# Altium project VOU_SOM_CV_V0.0.1.PrjPcb (part 1 of 2)
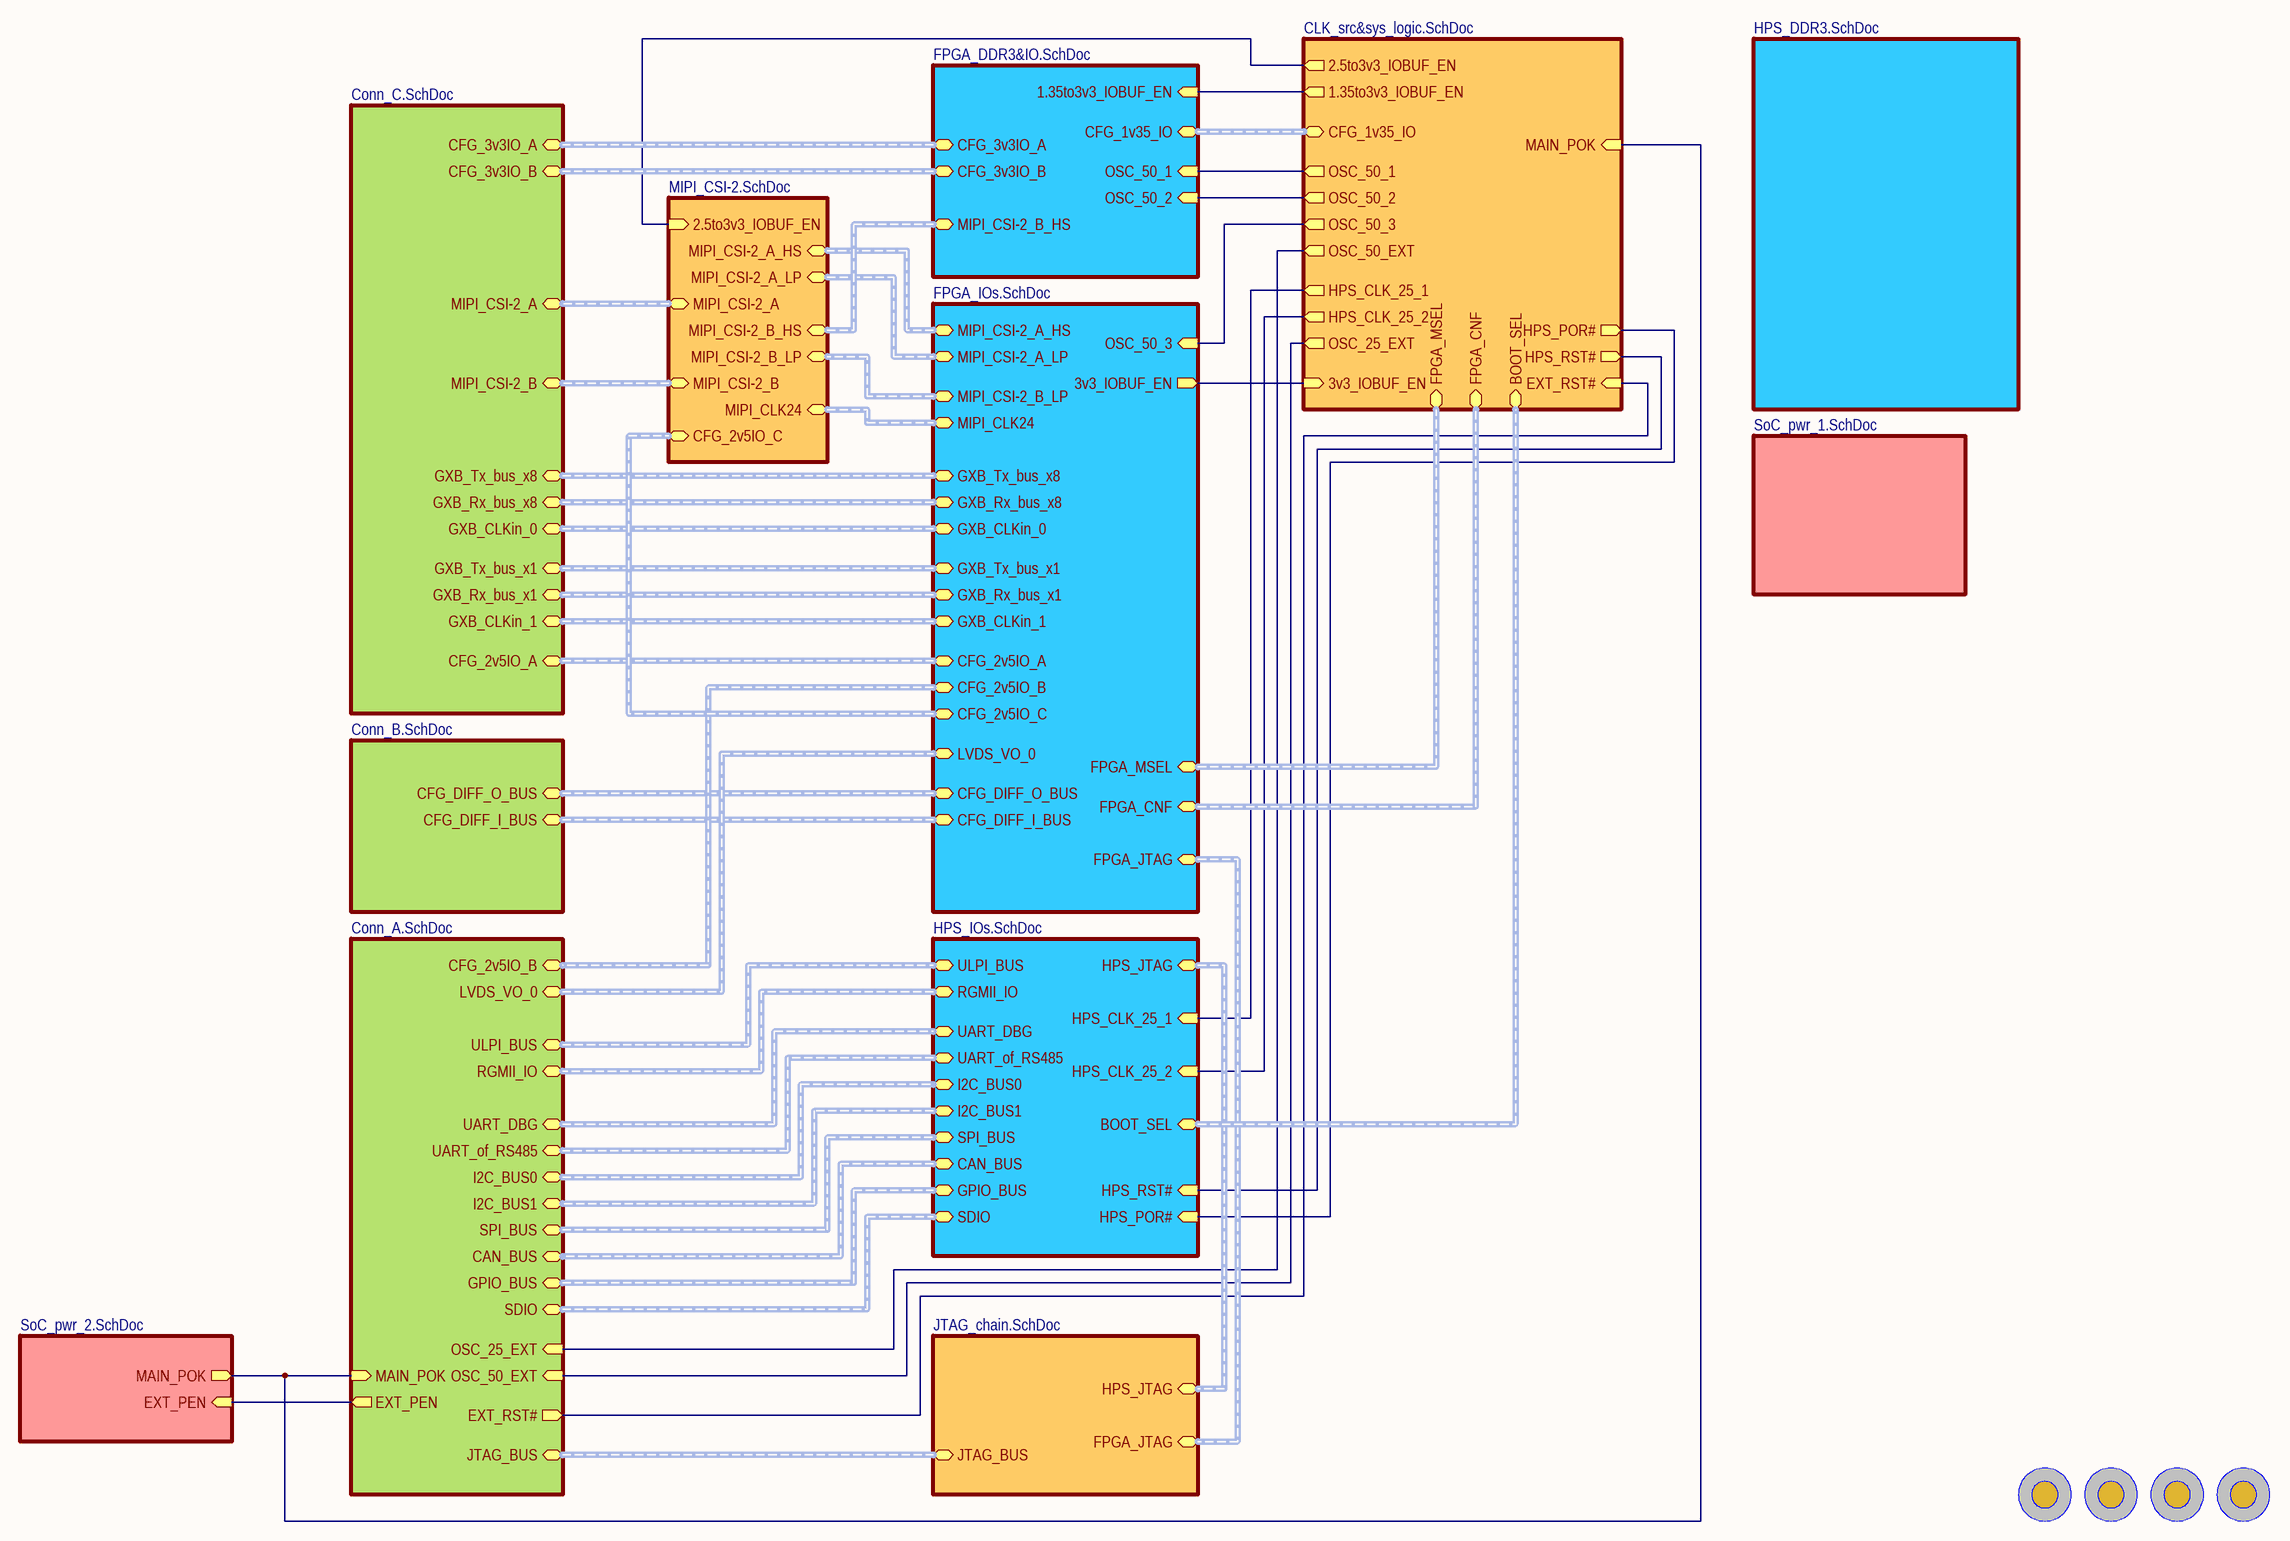
[diagram p0: VOU_SOM_CV_V0.0.1.SchDoc]
7 sheets, 106 parts. Net scope: hierarchical (ports join the sheet entries above them; power ports are global).
Board file: VOU_SOM_CV_V0.0.1.PcbDoc
Sheets:
  VOU_SOM_CV_V0.0.1.SchDoc
    Conn_A.SchDoc = Conn_A.SchDoc
    Conn_B.SchDoc = Conn_B.SchDoc
    Conn_C.SchDoc = Conn_C.SchDoc
    HPS_DDR3.SchDoc = HPS_DDR3.SchDoc
    HPS_IOs.SchDoc = HPS_IOs.SchDoc
    CLK_src&sys_logic.SchDoc = CLK_src&sys_logic.SchDoc

## Sheet VOU_SOM_CV_V0.0.1.SchDoc
size 593 x 419 mm; DocumentNumber: 1; SheetNumber: 1; SheetTotal: 12; Razrabotal: Савицкий

### Parts
RP_BL  Comment  [Reper-Normal]  (value not drawn)  (no BOM)
RP_BR  Comment  [Reper-Normal]  (value not drawn)  (no BOM)
RP_LT  Comment  [Reper-Normal]  (value not drawn)  (no BOM)
RP_RT  Comment  [Reper-Normal]  (value not drawn)  (no BOM)

### Sub-sheets
CLK_src&sys_logic.SchDoc = CLK_src&sys_logic.SchDoc: HPS_CLK_25_1 (out), HPS_CLK_25_2 (out), OSC_50_1 (out), OSC_50_2 (out), OSC_50_3 (out), OSC_50_EXT (out), OSC_25_EXT (out), MAIN_POK (in), EXT_RST# (in), 3v3_IOBUF_EN (in), 1.35to3v3_IOBUF_EN (out), 2.5to3v3_IOBUF_EN (out), HPS_RST# (out), HPS_POR# (out), FPGA_MSEL (harness FPGA_MSEL), FPGA_CNF (harness FPGA_CNF), BOOT_SEL (harness BOOT_SEL), CFG_1v35_IO (harness CFG_1v35_IO)
Conn_A.SchDoc = Conn_A.SchDoc: MAIN_POK (in), EXT_PEN (out), ULPI_BUS (harness ULPI_BUS), RGMII_IO (harness RGMII_IO), UART_DBG (harness UART_DBG), UART_of_RS485 (harness UART_of_RS485), I2C_BUS0 (harness I2C_BUS0), I2C_BUS1 (harness I2C_BUS1), SPI_BUS (harness SPI_BUS), CFG_2v5IO_B (harness CFG_2v5IO_B), JTAG_BUS (harness JTAG_BUS), LVDS_VO_0 (harness LVDS_VO_0), CAN_BUS (harness CAN_BUS), GPIO_BUS (harness GPIO_BUS), SDIO (harness SDIO), OSC_50_EXT (in), OSC_25_EXT (in), EXT_RST# (out)
Conn_B.SchDoc = Conn_B.SchDoc: CFG_DIFF_I_BUS (harness CFG_DIFF_I_BUS), CFG_DIFF_O_BUS (harness CFG_DIFF_O_BUS)
Conn_C.SchDoc = Conn_C.SchDoc: CFG_2v5IO_A (harness CFG_2v5IO_A), CFG_3v3IO_A (harness CFG_3v3IO_A), CFG_3v3IO_B (harness CFG_3v3IO_B), MIPI_CSI-2_A (harness MIPI_CSI-2_A), MIPI_CSI-2_B (harness MIPI_CSI-2_B), GXB_Tx_bus_x8 (harness GXB_Tx_bus_x8), GXB_Rx_bus_x1 (harness GXB_Rx_bus_x1), GXB_Rx_bus_x8 (harness GXB_Rx_bus_x8), GXB_Tx_bus_x1 (harness GXB_Tx_bus_x1), GXB_CLKin_0 (harness GXB_CLKin_0), GXB_CLKin_1 (harness GXB_CLKin_1)
DIMS_DSP_MainBoard_Interface.SchDoc = MIPI_CSI-2.SchDoc (file not in this document): MIPI_CSI-2_B_HS (harness MIPI_CSI-2_B_HS), MIPI_CSI-2_B_LP (harness MIPI_CSI-2_B_LP), MIPI_CSI-2_A_HS (harness MIPI_CSI-2_A_HS), MIPI_CSI-2_A_LP (harness MIPI_CSI-2_A_LP), MIPI_CSI-2_A (harness MIPI_CSI-2_A), MIPI_CSI-2_B (harness MIPI_CSI-2_B), MIPI_CLK24 (harness MIPI_CLK24), 2.5to3v3_IOBUF_EN (in), CFG_2v5IO_C (harness CFG_2v5IO_C)
FPGA_DDR3&IO.SchDoc = FPGA_DDR3&IO.SchDoc (file not in this document): MIPI_CSI-2_B_HS (harness MIPI_CSI-2_B_HS), CFG_3v3IO_A (harness CFG_3v3IO_A), CFG_3v3IO_B (harness CFG_3v3IO_B), OSC_50_1 (in), OSC_50_2 (in), 1.35to3v3_IOBUF_EN (in), CFG_1v35_IO (harness CFG_1v35_IO)
FPGA_IOs.SchDoc = FPGA_IOs.SchDoc (file not in this document): MIPI_CSI-2_B_LP (harness MIPI_CSI-2_B_LP), MIPI_CSI-2_A_LP (harness MIPI_CSI-2_A_LP), MIPI_CSI-2_A_HS (harness MIPI_CSI-2_A_HS), CFG_2v5IO_A (harness CFG_2v5IO_A), CFG_2v5IO_B (harness CFG_2v5IO_B), GXB_Rx_bus_x1 (harness GXB_Rx_bus_x1), GXB_Tx_bus_x1 (harness GXB_Tx_bus_x1), GXB_CLKin_1 (harness GXB_CLKin_1), GXB_Tx_bus_x8 (harness GXB_Tx_bus_x8), GXB_Rx_bus_x8 (harness GXB_Rx_bus_x8), GXB_CLKin_0 (harness GXB_CLKin_0), CFG_DIFF_I_BUS (harness CFG_DIFF_I_BUS), CFG_DIFF_O_BUS (harness CFG_DIFF_O_BUS), FPGA_JTAG (harness FPGA_JTAG), LVDS_VO_0 (harness LVDS_VO_0), FPGA_MSEL (harness FPGA_MSEL), OSC_50_3 (in), MIPI_CLK24 (harness MIPI_CLK24), 3v3_IOBUF_EN (out), FPGA_CNF (harness FPGA_CNF), CFG_2v5IO_C (harness CFG_2v5IO_C)
HPS_DDR3.SchDoc = HPS_DDR3.SchDoc: no entries
HPS_IOs.SchDoc = HPS_IOs.SchDoc: ULPI_BUS (harness ULPI_BUS), RGMII_IO (harness RGMII_IO), UART_DBG (harness UART_DBG), UART_of_RS485 (harness UART_of_RS485), I2C_BUS0 (harness I2C_BUS0), I2C_BUS1 (harness I2C_BUS1), SPI_BUS (harness SPI_BUS), CAN_BUS (harness CAN_BUS), GPIO_BUS (harness GPIO_BUS), HPS_JTAG (harness HPS_JTAG), SDIO (harness SDIO), HPS_CLK_25_1 (in), HPS_CLK_25_2 (in), HPS_RST# (in), HPS_POR# (in), BOOT_SEL (harness BOOT_SEL)
JTAG_chain.SchDoc = JTAG_chain.SchDoc (file not in this document): JTAG_BUS (harness JTAG_BUS), HPS_JTAG (harness HPS_JTAG), FPGA_JTAG (harness FPGA_JTAG)
SoC_pwr_1.SchDoc = SoC_pwr_1.SchDoc (file not in this document): no entries
SoC_pwr_2.SchDoc = SoC_pwr_2.SchDoc (file not in this document): MAIN_POK (out), EXT_PEN (in)

### Nets
1.35to3v3_IOBUF_EN: sheet FPGA_DDR3&IO.SchDoc/1.35to3v3_IOBUF_EN, sheet CLK_src&sys_logic.SchDoc/1.35to3v3_IOBUF_EN
2.5to3v3_IOBUF_EN: sheet DIMS_DSP_MainBoard_Interface.SchDoc/2.5to3v3_IOBUF_EN, sheet CLK_src&sys_logic.SchDoc/2.5to3v3_IOBUF_EN
3v3_IOBUF_EN: sheet FPGA_IOs.SchDoc/3v3_IOBUF_EN, sheet CLK_src&sys_logic.SchDoc/3v3_IOBUF_EN
EXT_PEN: sheet Conn_A.SchDoc/EXT_PEN, sheet SoC_pwr_2.SchDoc/EXT_PEN
EXT_RST#: sheet Conn_A.SchDoc/EXT_RST#, sheet CLK_src&sys_logic.SchDoc/EXT_RST#
HPS_CLK_25_1: sheet HPS_IOs.SchDoc/HPS_CLK_25_1, sheet CLK_src&sys_logic.SchDoc/HPS_CLK_25_1
HPS_CLK_25_2: sheet HPS_IOs.SchDoc/HPS_CLK_25_2, sheet CLK_src&sys_logic.SchDoc/HPS_CLK_25_2
MAIN_POK: sheet Conn_A.SchDoc/MAIN_POK, sheet CLK_src&sys_logic.SchDoc/MAIN_POK, sheet SoC_pwr_2.SchDoc/MAIN_POK
NetD2_C27: sheet HPS_IOs.SchDoc/HPS_RST#, sheet CLK_src&sys_logic.SchDoc/HPS_RST#
NetD2_F23: sheet HPS_IOs.SchDoc/HPS_POR#, sheet CLK_src&sys_logic.SchDoc/HPS_POR#
NetR4_2: sheet FPGA_DDR3&IO.SchDoc/OSC_50_1, sheet CLK_src&sys_logic.SchDoc/OSC_50_1
NetR5_2: sheet FPGA_DDR3&IO.SchDoc/OSC_50_2, sheet CLK_src&sys_logic.SchDoc/OSC_50_2
NetR6_2: sheet FPGA_IOs.SchDoc/OSC_50_3, sheet CLK_src&sys_logic.SchDoc/OSC_50_3
NetR7_2: sheet Conn_A.SchDoc/OSC_25_EXT, sheet CLK_src&sys_logic.SchDoc/OSC_50_EXT
NetR11_2: sheet Conn_A.SchDoc/OSC_50_EXT, sheet CLK_src&sys_logic.SchDoc/OSC_25_EXT

### Buses and harness runs
harness sheet CLK_src&sys_logic.SchDoc/BOOT_SEL = sheet HPS_IOs.SchDoc/BOOT_SEL
harness sheet CLK_src&sys_logic.SchDoc/CFG_1v35_IO = sheet FPGA_DDR3&IO.SchDoc/CFG_1v35_IO
harness sheet CLK_src&sys_logic.SchDoc/FPGA_CNF = sheet FPGA_IOs.SchDoc/FPGA_CNF
harness sheet CLK_src&sys_logic.SchDoc/FPGA_MSEL = sheet FPGA_IOs.SchDoc/FPGA_MSEL
harness sheet Conn_A.SchDoc/CAN_BUS = sheet HPS_IOs.SchDoc/CAN_BUS
harness sheet Conn_A.SchDoc/CFG_2v5IO_B = sheet FPGA_IOs.SchDoc/CFG_2v5IO_B
harness sheet Conn_A.SchDoc/GPIO_BUS = sheet HPS_IOs.SchDoc/GPIO_BUS
harness sheet Conn_A.SchDoc/I2C_BUS0 = sheet HPS_IOs.SchDoc/I2C_BUS0
harness sheet Conn_A.SchDoc/I2C_BUS1 = sheet HPS_IOs.SchDoc/I2C_BUS1
harness sheet Conn_A.SchDoc/JTAG_BUS = sheet JTAG_chain.SchDoc/JTAG_BUS
harness sheet Conn_A.SchDoc/LVDS_VO_0 = sheet FPGA_IOs.SchDoc/LVDS_VO_0
harness sheet Conn_A.SchDoc/RGMII_IO = sheet HPS_IOs.SchDoc/RGMII_IO
harness sheet Conn_A.SchDoc/SDIO = sheet HPS_IOs.SchDoc/SDIO
harness sheet Conn_A.SchDoc/SPI_BUS = sheet HPS_IOs.SchDoc/SPI_BUS
harness sheet Conn_A.SchDoc/UART_DBG = sheet HPS_IOs.SchDoc/UART_DBG
harness sheet Conn_A.SchDoc/UART_of_RS485 = sheet HPS_IOs.SchDoc/UART_of_RS485
harness sheet Conn_A.SchDoc/ULPI_BUS = sheet HPS_IOs.SchDoc/ULPI_BUS
harness sheet Conn_B.SchDoc/CFG_DIFF_I_BUS = sheet FPGA_IOs.SchDoc/CFG_DIFF_I_BUS
harness sheet Conn_B.SchDoc/CFG_DIFF_O_BUS = sheet FPGA_IOs.SchDoc/CFG_DIFF_O_BUS
harness sheet Conn_C.SchDoc/CFG_2v5IO_A = sheet FPGA_IOs.SchDoc/CFG_2v5IO_A
harness sheet Conn_C.SchDoc/CFG_3v3IO_A = sheet FPGA_DDR3&IO.SchDoc/CFG_3v3IO_A
harness sheet Conn_C.SchDoc/CFG_3v3IO_B = sheet FPGA_DDR3&IO.SchDoc/CFG_3v3IO_B
harness sheet Conn_C.SchDoc/GXB_CLKin_0 = sheet FPGA_IOs.SchDoc/GXB_CLKin_0
harness sheet Conn_C.SchDoc/GXB_CLKin_1 = sheet FPGA_IOs.SchDoc/GXB_CLKin_1
harness sheet Conn_C.SchDoc/GXB_Rx_bus_x1 = sheet FPGA_IOs.SchDoc/GXB_Rx_bus_x1
harness sheet Conn_C.SchDoc/GXB_Rx_bus_x8 = sheet FPGA_IOs.SchDoc/GXB_Rx_bus_x8
harness sheet Conn_C.SchDoc/GXB_Tx_bus_x1 = sheet FPGA_IOs.SchDoc/GXB_Tx_bus_x1
harness sheet Conn_C.SchDoc/GXB_Tx_bus_x8 = sheet FPGA_IOs.SchDoc/GXB_Tx_bus_x8
harness sheet Conn_C.SchDoc/MIPI_CSI-2_A = sheet DIMS_DSP_MainBoard_Interface.SchDoc/MIPI_CSI-2_A
harness sheet Conn_C.SchDoc/MIPI_CSI-2_B = sheet DIMS_DSP_MainBoard_Interface.SchDoc/MIPI_CSI-2_B
harness sheet DIMS_DSP_MainBoard_Interface.SchDoc/CFG_2v5IO_C = sheet FPGA_IOs.SchDoc/CFG_2v5IO_C
harness sheet DIMS_DSP_MainBoard_Interface.SchDoc/MIPI_CLK24 = sheet FPGA_IOs.SchDoc/MIPI_CLK24
harness sheet DIMS_DSP_MainBoard_Interface.SchDoc/MIPI_CSI-2_A_HS = sheet FPGA_IOs.SchDoc/MIPI_CSI-2_A_HS
harness sheet DIMS_DSP_MainBoard_Interface.SchDoc/MIPI_CSI-2_A_LP = sheet FPGA_IOs.SchDoc/MIPI_CSI-2_A_LP
harness sheet DIMS_DSP_MainBoard_Interface.SchDoc/MIPI_CSI-2_B_HS = sheet FPGA_DDR3&IO.SchDoc/MIPI_CSI-2_B_HS
harness sheet DIMS_DSP_MainBoard_Interface.SchDoc/MIPI_CSI-2_B_LP = sheet FPGA_IOs.SchDoc/MIPI_CSI-2_B_LP
harness sheet FPGA_IOs.SchDoc/FPGA_JTAG = sheet JTAG_chain.SchDoc/FPGA_JTAG
harness sheet HPS_IOs.SchDoc/HPS_JTAG = sheet JTAG_chain.SchDoc/HPS_JTAG

### Notes on the sheet
- Перв. примен.
- Справ. №
- Подп. и дата
- Инв. № дубл.
- Взам. инв. №
- Изм.
- Лист
- № докум.
- Подп.
- Дата
- Лит.
- Масса
- Масштаб
- Разраб.
- Пров.
- Т.контр.
- Схема электрическая принципиальная
- Листов
- Инв. № подл.
- Н.контр.
- Утв.
- Копировал:
- Формат А2

### Library data of the parts
RP_BL RP_BR RP_LT RP_RT = Reper: Стабилизатор положительного напряжения

## Sheet Conn_A.SchDoc
size A1
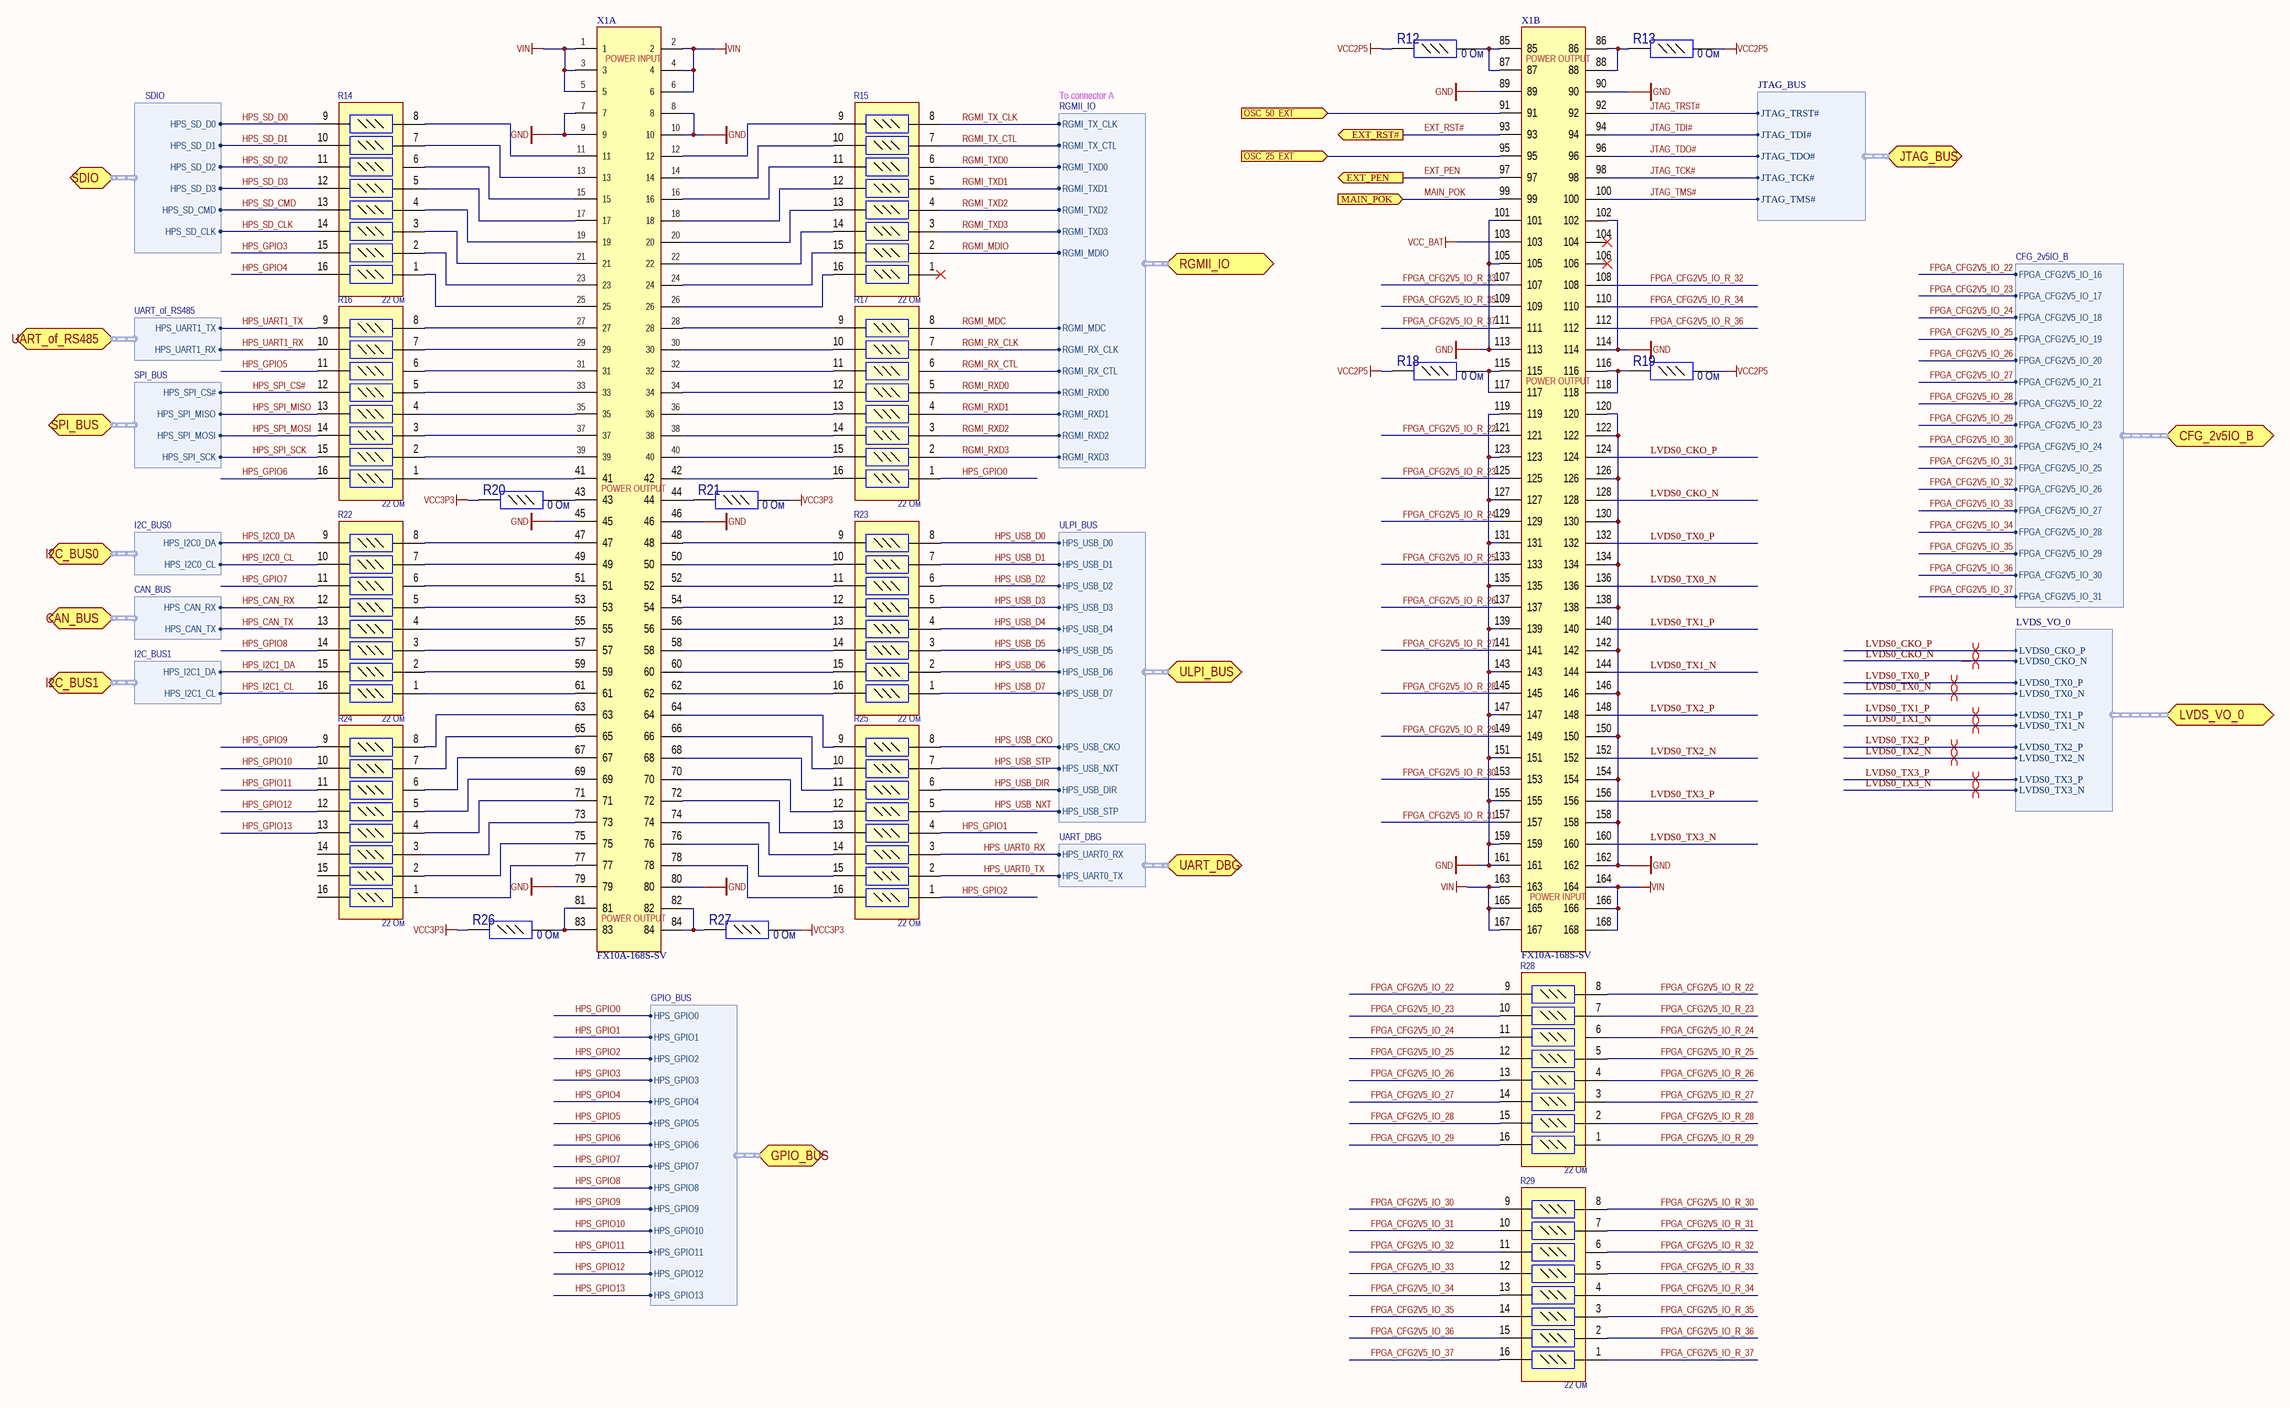
[diagram p1: Conn_A.SchDoc]

### Parts
R12  value 0 Ом  [CR0603]  (hidden comment: CR0603-0 Ом-±5%)
R13  value 0 Ом  [CR0603]  (hidden comment: CR0603-0 Ом-±5%)
R14  value 22 Ом  [CAT16-J8]  (hidden comment: YC248-JR-07-22 Ом)
R15  value 22 Ом  [CAT16-J8]  (hidden comment: YC248-JR-07-22 Ом)
R16  value 22 Ом  [CAT16-J8]  (hidden comment: YC248-JR-07-22 Ом)
R17  value 22 Ом  [CAT16-J8]  (hidden comment: YC248-JR-07-22 Ом)
R18  value 0 Ом  [CR0603]  (hidden comment: CR0603-0 Ом-±5%)
R19  value 0 Ом  [CR0603]  (hidden comment: CR0603-0 Ом-±5%)
R20  value 0 Ом  [CR0603]  (hidden comment: CR0603-0 Ом-±5%)
R21  value 0 Ом  [CR0603]  (hidden comment: CR0603-0 Ом-±5%)
R22  value 22 Ом  [CAT16-J8]  (hidden comment: YC248-JR-07-22 Ом)
R23  value 22 Ом  [CAT16-J8]  (hidden comment: YC248-JR-07-22 Ом)
R24  value 22 Ом  [CAT16-J8]  (hidden comment: YC248-JR-07-22 Ом)
R25  value 22 Ом  [CAT16-J8]  (hidden comment: YC248-JR-07-22 Ом)
R26  value 0 Ом  [CR0603]  (hidden comment: CR0603-0 Ом-±5%)
R27  value 0 Ом  [CR0603]  (hidden comment: CR0603-0 Ом-±5%)
R28  value 22 Ом  [CAT16-J8]  (hidden comment: YC248-JR-07-22 Ом)
R29  value 22 Ом  [CAT16-J8]  (hidden comment: YC248-JR-07-22 Ом)
X1  FX10A-168S-SV  [FX10A-168S-SV]  (parts A,B of 2)

### Ports
CAN_BUS (harness CAN_BUS), CFG_2v5IO_B (harness CFG_2v5IO_B), EXT_PEN (out), EXT_RST# (out), GPIO_BUS (harness GPIO_BUS), I2C_BUS0 (harness I2C_BUS0), I2C_BUS1 (harness I2C_BUS1), JTAG_BUS (harness JTAG_BUS), LVDS_VO_0 (harness LVDS_VO_0), MAIN_POK (in), OSC_25_EXT (in), OSC_50_EXT (in), RGMII_IO (harness RGMII_IO), SDIO (harness SDIO), SPI_BUS (harness SPI_BUS), UART_DBG (harness UART_DBG), UART_of_RS485 (harness UART_of_RS485), ULPI_BUS (harness ULPI_BUS)

### Harnesses
LVDS_VO_0: LVDS0_CKO_P, LVDS0_CKO_N, LVDS0_TX0_P, LVDS0_TX0_N, LVDS0_TX1_P, LVDS0_TX1_N, LVDS0_TX2_P, LVDS0_TX2_N, LVDS0_TX3_P, LVDS0_TX3_N
JTAG_BUS: JTAG_TRST#, JTAG_TDI#, JTAG_TDO#, JTAG_TCK#, JTAG_TMS#
SDIO: HPS_SD_D0, HPS_SD_D1, HPS_SD_D2, HPS_SD_D3, HPS_SD_CMD, HPS_SD_CLK
ULPI_BUS: HPS_USB_D0, HPS_USB_D1, HPS_USB_D2, HPS_USB_D3, HPS_USB_D4, HPS_USB_D5, HPS_USB_D6, HPS_USB_D7, HPS_USB_CKO, HPS_USB_NXT, HPS_USB_DIR, HPS_USB_STP
UART_DBG: HPS_UART0_RX, HPS_UART0_TX
UART_of_RS485: HPS_UART1_RX, HPS_UART1_TX
GPIO_BUS: HPS_GPIO0, HPS_GPIO1, HPS_GPIO2, HPS_GPIO3, HPS_GPIO4, HPS_GPIO5, HPS_GPIO6, HPS_GPIO7, HPS_GPIO8, HPS_GPIO9, HPS_GPIO10, HPS_GPIO11, HPS_GPIO12, HPS_GPIO13
SPI_BUS: HPS_SPI_MOSI, HPS_SPI_MISO, HPS_SPI_SCK, HPS_SPI_CS#
I2C_BUS0: HPS_I2C0_DA, HPS_I2C0_CL
I2C_BUS1: HPS_I2C1_DA, HPS_I2C1_CL
CAN_BUS: HPS_CAN_TX, HPS_CAN_RX
RGMII_IO: RGMI_TX_CLK, RGMI_TXD0, RGMI_TXD1, RGMI_TXD2, RGMI_TXD3, RGMI_RXD0, RGMI_RXD1, RGMI_RXD2, RGMI_RXD3, RGMI_TX_CTL, RGMI_RX_CTL, RGMI_RX_CLK, RGMI_MDIO, RGMI_MDC
CFG_2v5IO_B: FPGA_CFG2V5_IO_16, FPGA_CFG2V5_IO_17, FPGA_CFG2V5_IO_18, FPGA_CFG2V5_IO_19, FPGA_CFG2V5_IO_20, FPGA_CFG2V5_IO_21, FPGA_CFG2V5_IO_22, FPGA_CFG2V5_IO_23, FPGA_CFG2V5_IO_24, FPGA_CFG2V5_IO_25, FPGA_CFG2V5_IO_26, FPGA_CFG2V5_IO_27, FPGA_CFG2V5_IO_28, FPGA_CFG2V5_IO_29, FPGA_CFG2V5_IO_30, FPGA_CFG2V5_IO_31

### Nets
GND: X1.7 X1.8 X1.9 X1.10 X1.45 X1.46 X1.79 X1.80 X1.89 X1.90 X1.101 X1.102 X1.105 X1.113 X1.114 X1.119 X1.120 X1.122 X1.123 X1.126 X1.127 X1.130 X1.131 X1.134 X1.135 X1.138 X1.139 X1.142 X1.143 X1.146 X1.147 X1.150 X1.151 X1.154 X1.155 X1.158 X1.159 X1.161 X1.162
VCC2P5: R12.1(+) R13.2(-) R18.1(+) R19.2(-)
VCC3P3: R20.1(+) R21.2(-) R26.1(+) R27.2(-)
VCC_BAT: X1.103
VIN: X1.1 X1.2 X1.3 X1.4 X1.5 X1.6 X1.163 X1.164 X1.165 X1.166 X1.167 X1.168
EXT_PEN: X1.97 ; port EXT_PEN
EXT_RST#: X1.93 ; port EXT_RST#
FPGA_CFG2V5_IO_22: R28.9 ; port CFG_2v5IO_B.FPGA_CFG2V5_IO_16
FPGA_CFG2V5_IO_23: R28.10 ; port CFG_2v5IO_B.FPGA_CFG2V5_IO_17
FPGA_CFG2V5_IO_24: R28.11 ; port CFG_2v5IO_B.FPGA_CFG2V5_IO_18
FPGA_CFG2V5_IO_25: R28.12 ; port CFG_2v5IO_B.FPGA_CFG2V5_IO_19
FPGA_CFG2V5_IO_26: R28.13 ; port CFG_2v5IO_B.FPGA_CFG2V5_IO_20
FPGA_CFG2V5_IO_27: R28.14 ; port CFG_2v5IO_B.FPGA_CFG2V5_IO_21
FPGA_CFG2V5_IO_28: R28.15 ; port CFG_2v5IO_B.FPGA_CFG2V5_IO_22
FPGA_CFG2V5_IO_29: R28.16 ; port CFG_2v5IO_B.FPGA_CFG2V5_IO_23
FPGA_CFG2V5_IO_30: R29.9 ; port CFG_2v5IO_B.FPGA_CFG2V5_IO_24
FPGA_CFG2V5_IO_31: R29.10 ; port CFG_2v5IO_B.FPGA_CFG2V5_IO_25
FPGA_CFG2V5_IO_32: R29.11 ; port CFG_2v5IO_B.FPGA_CFG2V5_IO_26
FPGA_CFG2V5_IO_33: R29.12 ; port CFG_2v5IO_B.FPGA_CFG2V5_IO_27
FPGA_CFG2V5_IO_34: R29.13 ; port CFG_2v5IO_B.FPGA_CFG2V5_IO_28
FPGA_CFG2V5_IO_35: R29.14 ; port CFG_2v5IO_B.FPGA_CFG2V5_IO_29
FPGA_CFG2V5_IO_36: R29.15 ; port CFG_2v5IO_B.FPGA_CFG2V5_IO_30
FPGA_CFG2V5_IO_37: R29.16 ; port CFG_2v5IO_B.FPGA_CFG2V5_IO_31
FPGA_CFG2V5_IO_R_22: R28.8 X1.121
FPGA_CFG2V5_IO_R_23: R28.7 X1.125
FPGA_CFG2V5_IO_R_24: R28.6 X1.129
FPGA_CFG2V5_IO_R_25: R28.5 X1.133
FPGA_CFG2V5_IO_R_26: R28.4 X1.137
FPGA_CFG2V5_IO_R_27: R28.3 X1.141
FPGA_CFG2V5_IO_R_28: R28.2 X1.145
FPGA_CFG2V5_IO_R_29: R28.1 X1.149
FPGA_CFG2V5_IO_R_30: R29.8 X1.153
FPGA_CFG2V5_IO_R_31: R29.7 X1.157
FPGA_CFG2V5_IO_R_32: R29.6 X1.108
FPGA_CFG2V5_IO_R_33: R29.5 X1.107
FPGA_CFG2V5_IO_R_34: R29.4 X1.110
FPGA_CFG2V5_IO_R_35: R29.3 X1.109
FPGA_CFG2V5_IO_R_36: R29.2 X1.112
FPGA_CFG2V5_IO_R_37: R29.1 X1.111
HPS_CAN_RX: R22.12 ; port CAN_BUS.HPS_CAN_RX
HPS_CAN_TX: R22.13 ; port CAN_BUS.HPS_CAN_TX
HPS_GPIO0: R17.1 ; port GPIO_BUS.HPS_GPIO0
HPS_GPIO1: R25.4 ; port GPIO_BUS.HPS_GPIO1
HPS_GPIO2: R25.1 ; port GPIO_BUS.HPS_GPIO2
HPS_GPIO3: R14.15 ; port GPIO_BUS.HPS_GPIO3
HPS_GPIO4: R14.16 ; port GPIO_BUS.HPS_GPIO4
HPS_GPIO5: R16.11 ; port GPIO_BUS.HPS_GPIO5
HPS_GPIO6: R16.16 ; port GPIO_BUS.HPS_GPIO6
HPS_GPIO7: R22.11 ; port GPIO_BUS.HPS_GPIO7
HPS_GPIO8: R22.14 ; port GPIO_BUS.HPS_GPIO8
HPS_GPIO9: R24.9 ; port GPIO_BUS.HPS_GPIO9
HPS_GPIO10: R24.10 ; port GPIO_BUS.HPS_GPIO10
HPS_GPIO11: R24.11 ; port GPIO_BUS.HPS_GPIO11
HPS_GPIO12: R24.12 ; port GPIO_BUS.HPS_GPIO12
HPS_GPIO13: R24.13 ; port GPIO_BUS.HPS_GPIO13
HPS_I2C0_CL: R22.10 ; port I2C_BUS0.HPS_I2C0_CL
HPS_I2C0_DA: R22.9 ; port I2C_BUS0.HPS_I2C0_DA
HPS_I2C1_CL: R22.16 ; port I2C_BUS1.HPS_I2C1_CL
HPS_I2C1_DA: R22.15 ; port I2C_BUS1.HPS_I2C1_DA
HPS_SD_CLK: R14.14 ; port SDIO.HPS_SD_CLK
HPS_SD_CMD: R14.13 ; port SDIO.HPS_SD_CMD
HPS_SD_D0: R14.9 ; port SDIO.HPS_SD_D0
HPS_SD_D1: R14.10 ; port SDIO.HPS_SD_D1
HPS_SD_D2: R14.11 ; port SDIO.HPS_SD_D2
HPS_SD_D3: R14.12 ; port SDIO.HPS_SD_D3
HPS_SPI_CS#: R16.12 ; port SPI_BUS.HPS_SPI_CS#  [project net HPS_BSL0]
HPS_SPI_MISO: R16.13 ; port SPI_BUS.HPS_SPI_MISO
HPS_SPI_MOSI: R16.14 ; port SPI_BUS.HPS_SPI_MOSI
HPS_SPI_SCK: R16.15 ; port SPI_BUS.HPS_SPI_SCK
HPS_UART0_RX: R25.3 ; port UART_DBG.HPS_UART0_RX
HPS_UART0_TX: R25.2 ; port UART_DBG.HPS_UART0_TX
HPS_UART1_RX: R16.10 ; port UART_of_RS485.HPS_UART1_RX
HPS_UART1_TX: R16.9 ; port UART_of_RS485.HPS_UART1_TX
HPS_USB_CKO: R25.8 ; port ULPI_BUS.HPS_USB_CKO
HPS_USB_D0: R23.8 ; port ULPI_BUS.HPS_USB_D0
HPS_USB_D1: R23.7 ; port ULPI_BUS.HPS_USB_D1
HPS_USB_D2: R23.6 ; port ULPI_BUS.HPS_USB_D2
HPS_USB_D3: R23.5 ; port ULPI_BUS.HPS_USB_D3
HPS_USB_D4: R23.4 ; port ULPI_BUS.HPS_USB_D4
HPS_USB_D5: R23.3 ; port ULPI_BUS.HPS_USB_D5
HPS_USB_D6: R23.2 ; port ULPI_BUS.HPS_USB_D6
HPS_USB_D7: R23.1 ; port ULPI_BUS.HPS_USB_D7
HPS_USB_DIR: R25.6 ; port ULPI_BUS.HPS_USB_DIR
HPS_USB_NXT: R25.5 ; port ULPI_BUS.HPS_USB_STP
HPS_USB_STP: R25.7 ; port ULPI_BUS.HPS_USB_NXT
JTAG_TCK#: X1.98 ; port JTAG_BUS.JTAG_TCK#
JTAG_TDI#: X1.94 ; port JTAG_BUS.JTAG_TDI#
JTAG_TDO#: X1.96 ; port JTAG_BUS.JTAG_TDO#
JTAG_TMS#: X1.100 ; port JTAG_BUS.JTAG_TMS#
JTAG_TRST#: X1.92 ; port JTAG_BUS.JTAG_TRST#
LVDS0_CKO_N: X1.128 ; port LVDS_VO_0.LVDS0_CKO_N
LVDS0_CKO_P: X1.124 ; port LVDS_VO_0.LVDS0_CKO_P
LVDS0_TX0_N: X1.136 ; port LVDS_VO_0.LVDS0_TX0_N
LVDS0_TX0_P: X1.132 ; port LVDS_VO_0.LVDS0_TX0_P
LVDS0_TX1_N: X1.144 ; port LVDS_VO_0.LVDS0_TX1_N
LVDS0_TX1_P: X1.140 ; port LVDS_VO_0.LVDS0_TX1_P
LVDS0_TX2_N: X1.152 ; port LVDS_VO_0.LVDS0_TX2_N
LVDS0_TX2_P: X1.148 ; port LVDS_VO_0.LVDS0_TX2_P
LVDS0_TX3_N: X1.160 ; port LVDS_VO_0.LVDS0_TX3_N
LVDS0_TX3_P: X1.156 ; port LVDS_VO_0.LVDS0_TX3_P
MAIN_POK: X1.99 ; port MAIN_POK
RGMI_MDC: R17.8 ; port RGMII_IO.RGMI_MDC
RGMI_MDIO: R15.2 ; port RGMII_IO.RGMI_MDIO
RGMI_RX_CLK: R17.7 ; port RGMII_IO.RGMI_RX_CLK
RGMI_RX_CTL: R17.6 ; port RGMII_IO.RGMI_RX_CTL
RGMI_RXD0: R17.5 ; port RGMII_IO.RGMI_RXD0
RGMI_RXD1: R17.4 ; port RGMII_IO.RGMI_RXD1
RGMI_RXD2: R17.3 ; port RGMII_IO.RGMI_RXD2
RGMI_RXD3: R17.2 ; port RGMII_IO.RGMI_RXD3
RGMI_TX_CLK: R15.8 ; port RGMII_IO.RGMI_TX_CLK
RGMI_TX_CTL: R15.7 ; port RGMII_IO.RGMI_TX_CTL
RGMI_TXD0: R15.6 ; port RGMII_IO.RGMI_TXD0
RGMI_TXD1: R15.5 ; port RGMII_IO.RGMI_TXD1
RGMI_TXD2: R15.4 ; port RGMII_IO.RGMI_TXD2
RGMI_TXD3: R15.3 ; port RGMII_IO.RGMI_TXD3
NetR7_2: X1.95 ; port OSC_25_EXT
NetR11_2: X1.91 ; port OSC_50_EXT
NetR12_2: R12.2(-) X1.85 X1.87
NetR13_1: R13.1(+) X1.86 X1.88
NetR14_1: R14.1 X1.25
NetR14_2: R14.2 X1.23
NetR14_3: R14.3 X1.21
NetR14_4: R14.4 X1.19
NetR14_5: R14.5 X1.17
NetR14_6: R14.6 X1.15
NetR14_7: R14.7 X1.13
NetR14_8: R14.8 X1.11
NetR15_9: R15.9 X1.12
NetR15_10: R15.10 X1.14
NetR15_11: R15.11 X1.16
NetR15_12: R15.12 X1.18
NetR15_13: R15.13 X1.20
NetR15_14: R15.14 X1.22
NetR15_15: R15.15 X1.24
NetR15_16: R15.16 X1.26
NetR16_1: R16.1 X1.41
NetR16_2: R16.2 X1.39
NetR16_3: R16.3 X1.37
NetR16_4: R16.4 X1.35
NetR16_5: R16.5 X1.33
NetR16_6: R16.6 X1.31
NetR16_7: R16.7 X1.29
NetR16_8: R16.8 X1.27
NetR17_9: R17.9 X1.28
NetR17_10: R17.10 X1.30
NetR17_11: R17.11 X1.32
NetR17_12: R17.12 X1.34
NetR17_13: R17.13 X1.36
NetR17_14: R17.14 X1.38
NetR17_15: R17.15 X1.40
NetR17_16: R17.16 X1.42
NetR18_2: R18.2(-) X1.115 X1.117
NetR19_1: R19.1(+) X1.116 X1.118
NetR20_2: R20.2(-) X1.43
NetR21_1: R21.1(+) X1.44
NetR22_1: R22.1 X1.61
NetR22_2: R22.2 X1.59
NetR22_3: R22.3 X1.57
NetR22_4: R22.4 X1.55
NetR22_5: R22.5 X1.53
NetR22_6: R22.6 X1.51
NetR22_7: R22.7 X1.49
NetR22_8: R22.8 X1.47
NetR23_9: R23.9 X1.48
NetR23_10: R23.10 X1.50
NetR23_11: R23.11 X1.52
NetR23_12: R23.12 X1.54
NetR23_13: R23.13 X1.56
NetR23_14: R23.14 X1.58
NetR23_15: R23.15 X1.60
NetR23_16: R23.16 X1.62
NetR24_1: R24.1 X1.77
NetR24_2: R24.2 X1.75
NetR24_3: R24.3 X1.73
NetR24_4: R24.4 X1.71
NetR24_5: R24.5 X1.69
NetR24_6: R24.6 X1.67
NetR24_7: R24.7 X1.65
NetR24_8: R24.8 X1.63
NetR25_9: R25.9 X1.64
NetR25_10: R25.10 X1.66
NetR25_11: R25.11 X1.68
NetR25_12: R25.12 X1.70
NetR25_13: R25.13 X1.72
NetR25_14: R25.14 X1.74
NetR25_15: R25.15 X1.76
NetR25_16: R25.16 X1.78
NetR26_2: R26.2(-) X1.81 X1.83
NetR27_1: R27.1(+) X1.82 X1.84

Not connected (* = marked no-connect by the designer): R15 1*; R24 14 15 16; X1 104* 106*

### Layout directives
differential pair: LVDS0_CKO_N, LVDS0_CKO_P, LVDS0_TX0_N, LVDS0_TX0_P, LVDS0_TX1_N, LVDS0_TX1_P, LVDS0_TX2_N, LVDS0_TX2_P, LVDS0_TX3_N, LVDS0_TX3_P

### Notes on the sheet
- (near X1) POWER INPUT
- To connector A
- (near X1) POWER OUTPUT

### Library data of the parts
R12 R13 R18-R21 R26 R27 = CR0603-#-±5%: Чип резистор
R14-R17 R22-R25 R28 R29 = YC248-JR-07-#: Набор чип резисторов; P: 0.062 Вт; Supplier 1: Digi-Key; Supplier Part Number 1: YC248-JR-0722RL

## Sheet Conn_B.SchDoc
size A1
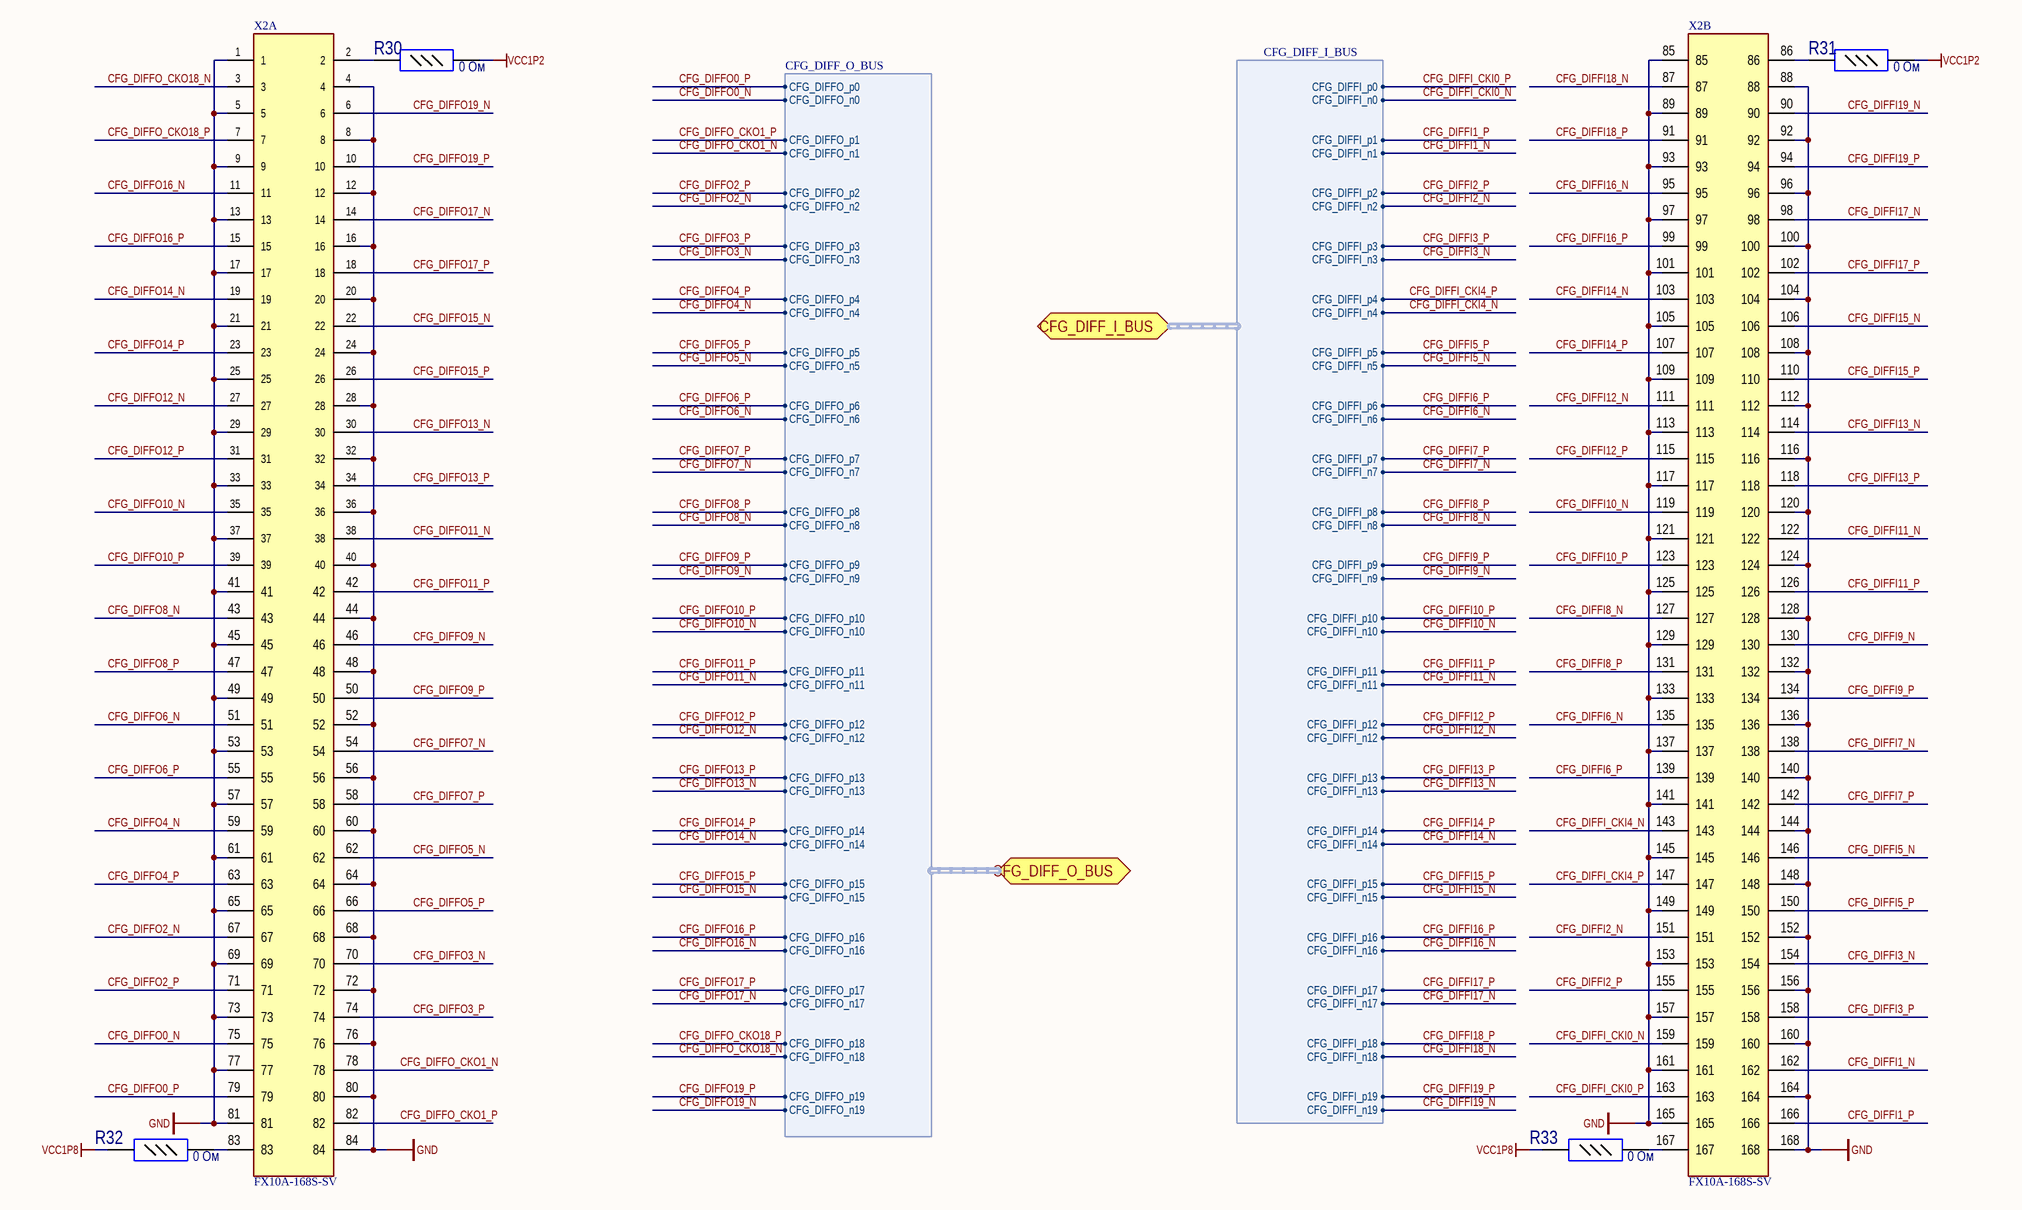
[diagram p2: Conn_B.SchDoc]

### Parts
R30  value 0 Ом  [CR0603]  (hidden comment: CR0603-0 Ом-±5%)
R31  value 0 Ом  [CR0603]  (hidden comment: CR0603-0 Ом-±5%)
R32  value 0 Ом  [CR0603]  (hidden comment: CR0603-0 Ом-±5%)
R33  value 0 Ом  [CR0603]  (hidden comment: CR0603-0 Ом-±5%)
X2  FX10A-168S-SV  [FX10A-168S-SV]  (parts A,B of 2)

### Ports
CFG_DIFF_I_BUS (harness CFG_DIFF_I_BUS), CFG_DIFF_O_BUS (harness CFG_DIFF_O_BUS)

### Harnesses
CFG_DIFF_I_BUS: CFG_DIFFI_p0, CFG_DIFFI_p1, CFG_DIFFI_p2, CFG_DIFFI_p3, CFG_DIFFI_p4, CFG_DIFFI_p5, CFG_DIFFI_p6, CFG_DIFFI_p7, CFG_DIFFI_p8, CFG_DIFFI_p9, CFG_DIFFI_p10, CFG_DIFFI_p11, CFG_DIFFI_p12, CFG_DIFFI_p13, CFG_DIFFI_p14, CFG_DIFFI_p15, CFG_DIFFI_p16, CFG_DIFFI_p17, CFG_DIFFI_p18, CFG_DIFFI_p19, CFG_DIFFI_n0, CFG_DIFFI_n1, CFG_DIFFI_n2, CFG_DIFFI_n3, CFG_DIFFI_n4, CFG_DIFFI_n5, CFG_DIFFI_n6, CFG_DIFFI_n7, CFG_DIFFI_n8, CFG_DIFFI_n9, CFG_DIFFI_n10, CFG_DIFFI_n11, CFG_DIFFI_n12, CFG_DIFFI_n13, CFG_DIFFI_n14, CFG_DIFFI_n15, CFG_DIFFI_n16, CFG_DIFFI_n17, CFG_DIFFI_n18, CFG_DIFFI_n19
CFG_DIFF_O_BUS: CFG_DIFFO_p0, CFG_DIFFO_n0, CFG_DIFFO_p1, CFG_DIFFO_p2, CFG_DIFFO_p3, CFG_DIFFO_p4, CFG_DIFFO_p5, CFG_DIFFO_p6, CFG_DIFFO_p7, CFG_DIFFO_p8, CFG_DIFFO_p9, CFG_DIFFO_p10, CFG_DIFFO_p11, CFG_DIFFO_p12, CFG_DIFFO_p13, CFG_DIFFO_p14, CFG_DIFFO_p15, CFG_DIFFO_p16, CFG_DIFFO_p17, CFG_DIFFO_p18, CFG_DIFFO_p19, CFG_DIFFO_n1, CFG_DIFFO_n2, CFG_DIFFO_n3, CFG_DIFFO_n4, CFG_DIFFO_n5, CFG_DIFFO_n6, CFG_DIFFO_n7, CFG_DIFFO_n8, CFG_DIFFO_n9, CFG_DIFFO_n10, CFG_DIFFO_n11, CFG_DIFFO_n12, CFG_DIFFO_n13, CFG_DIFFO_n14, CFG_DIFFO_n15, CFG_DIFFO_n16, CFG_DIFFO_n17, CFG_DIFFO_n18, CFG_DIFFO_n19

### Nets
GND: X2.1 X2.4 X2.5 X2.8 X2.9 X2.12 X2.13 X2.16 X2.17 X2.20 X2.21 X2.24 X2.25 X2.28 X2.29 X2.32 X2.33 X2.36 X2.37 X2.40 X2.41 X2.44 X2.45 X2.48 X2.49 X2.52 X2.53 X2.56 X2.57 X2.60 X2.61 X2.64 X2.65 X2.68 X2.69 X2.72 X2.73 X2.76 X2.77 X2.80 X2.81 X2.84 X2.85 X2.88 X2.89 X2.92 X2.93 X2.96 X2.97 X2.100 X2.101 X2.104 X2.105 X2.108 X2.109 X2.112 X2.113 X2.116 X2.117 X2.120 X2.121 X2.124 X2.125 X2.128 X2.129 X2.132 X2.133 X2.136 X2.137 X2.140 X2.141 X2.144 X2.145 X2.148 X2.149 X2.152 X2.153 X2.156 X2.157 X2.160 X2.161 X2.164 X2.165 X2.168
VCC1P2: R30.2(-) R31.2(-)
VCC1P8: R32.1(+) R33.1(+)
CFG_DIFFI1_N: X2.162 ; port CFG_DIFF_I_BUS.CFG_DIFFI_n1
CFG_DIFFI1_P: X2.166 ; port CFG_DIFF_I_BUS.CFG_DIFFI_p1
CFG_DIFFI2_N: X2.151 ; port CFG_DIFF_I_BUS.CFG_DIFFI_n2
CFG_DIFFI2_P: X2.155 ; port CFG_DIFF_I_BUS.CFG_DIFFI_p2
CFG_DIFFI3_N: X2.154 ; port CFG_DIFF_I_BUS.CFG_DIFFI_n3
CFG_DIFFI3_P: X2.158 ; port CFG_DIFF_I_BUS.CFG_DIFFI_p3
CFG_DIFFI5_N: X2.146 ; port CFG_DIFF_I_BUS.CFG_DIFFI_n5
CFG_DIFFI5_P: X2.150 ; port CFG_DIFF_I_BUS.CFG_DIFFI_p5
CFG_DIFFI6_N: X2.135 ; port CFG_DIFF_I_BUS.CFG_DIFFI_n6
CFG_DIFFI6_P: X2.139 ; port CFG_DIFF_I_BUS.CFG_DIFFI_p6
CFG_DIFFI7_N: X2.138 ; port CFG_DIFF_I_BUS.CFG_DIFFI_n7
CFG_DIFFI7_P: X2.142 ; port CFG_DIFF_I_BUS.CFG_DIFFI_p7
CFG_DIFFI8_N: X2.127 ; port CFG_DIFF_I_BUS.CFG_DIFFI_n8
CFG_DIFFI8_P: X2.131 ; port CFG_DIFF_I_BUS.CFG_DIFFI_p8
CFG_DIFFI9_N: X2.130 ; port CFG_DIFF_I_BUS.CFG_DIFFI_n9
CFG_DIFFI9_P: X2.134 ; port CFG_DIFF_I_BUS.CFG_DIFFI_p9
CFG_DIFFI10_N: X2.119 ; port CFG_DIFF_I_BUS.CFG_DIFFI_n10
CFG_DIFFI10_P: X2.123 ; port CFG_DIFF_I_BUS.CFG_DIFFI_p10
CFG_DIFFI11_N: X2.122 ; port CFG_DIFF_I_BUS.CFG_DIFFI_n11
CFG_DIFFI11_P: X2.126 ; port CFG_DIFF_I_BUS.CFG_DIFFI_p11
CFG_DIFFI12_N: X2.111 ; port CFG_DIFF_I_BUS.CFG_DIFFI_n12
CFG_DIFFI12_P: X2.115 ; port CFG_DIFF_I_BUS.CFG_DIFFI_p12
CFG_DIFFI13_N: X2.114 ; port CFG_DIFF_I_BUS.CFG_DIFFI_n13
CFG_DIFFI13_P: X2.118 ; port CFG_DIFF_I_BUS.CFG_DIFFI_p13
CFG_DIFFI14_N: X2.103 ; port CFG_DIFF_I_BUS.CFG_DIFFI_n14
CFG_DIFFI14_P: X2.107 ; port CFG_DIFF_I_BUS.CFG_DIFFI_p14
CFG_DIFFI15_N: X2.106 ; port CFG_DIFF_I_BUS.CFG_DIFFI_n15
CFG_DIFFI15_P: X2.110 ; port CFG_DIFF_I_BUS.CFG_DIFFI_p15
CFG_DIFFI16_N: X2.95 ; port CFG_DIFF_I_BUS.CFG_DIFFI_n16
CFG_DIFFI16_P: X2.99 ; port CFG_DIFF_I_BUS.CFG_DIFFI_p16
CFG_DIFFI17_N: X2.98 ; port CFG_DIFF_I_BUS.CFG_DIFFI_n17
CFG_DIFFI17_P: X2.102 ; port CFG_DIFF_I_BUS.CFG_DIFFI_p17
CFG_DIFFI18_N: X2.87 ; port CFG_DIFF_I_BUS.CFG_DIFFI_n18
CFG_DIFFI18_P: X2.91 ; port CFG_DIFF_I_BUS.CFG_DIFFI_p18
CFG_DIFFI19_N: X2.90 ; port CFG_DIFF_I_BUS.CFG_DIFFI_n19
CFG_DIFFI19_P: X2.94 ; port CFG_DIFF_I_BUS.CFG_DIFFI_p19
CFG_DIFFI_CKI0_N: X2.159 ; port CFG_DIFF_I_BUS.CFG_DIFFI_n0
CFG_DIFFI_CKI0_P: X2.163 ; port CFG_DIFF_I_BUS.CFG_DIFFI_p0
CFG_DIFFI_CKI4_N: X2.143 ; port CFG_DIFF_I_BUS.CFG_DIFFI_n4
CFG_DIFFI_CKI4_P: X2.147 ; port CFG_DIFF_I_BUS.CFG_DIFFI_p4
CFG_DIFFO0_N: X2.75 ; port CFG_DIFF_O_BUS.CFG_DIFFO_n0
CFG_DIFFO0_P: X2.79 ; port CFG_DIFF_O_BUS.CFG_DIFFO_p0
CFG_DIFFO2_N: X2.67 ; port CFG_DIFF_O_BUS.CFG_DIFFO_n2
CFG_DIFFO2_P: X2.71 ; port CFG_DIFF_O_BUS.CFG_DIFFO_p2
CFG_DIFFO3_N: X2.70 ; port CFG_DIFF_O_BUS.CFG_DIFFO_n3
CFG_DIFFO3_P: X2.74 ; port CFG_DIFF_O_BUS.CFG_DIFFO_p3
CFG_DIFFO4_N: X2.59 ; port CFG_DIFF_O_BUS.CFG_DIFFO_n4
CFG_DIFFO4_P: X2.63 ; port CFG_DIFF_O_BUS.CFG_DIFFO_p4
CFG_DIFFO5_N: X2.62 ; port CFG_DIFF_O_BUS.CFG_DIFFO_n5
CFG_DIFFO5_P: X2.66 ; port CFG_DIFF_O_BUS.CFG_DIFFO_p5
CFG_DIFFO6_N: X2.51 ; port CFG_DIFF_O_BUS.CFG_DIFFO_n6
CFG_DIFFO6_P: X2.55 ; port CFG_DIFF_O_BUS.CFG_DIFFO_p6
CFG_DIFFO7_N: X2.54 ; port CFG_DIFF_O_BUS.CFG_DIFFO_n7
CFG_DIFFO7_P: X2.58 ; port CFG_DIFF_O_BUS.CFG_DIFFO_p7
CFG_DIFFO8_N: X2.43 ; port CFG_DIFF_O_BUS.CFG_DIFFO_n8
CFG_DIFFO8_P: X2.47 ; port CFG_DIFF_O_BUS.CFG_DIFFO_p8
CFG_DIFFO9_N: X2.46 ; port CFG_DIFF_O_BUS.CFG_DIFFO_n9
CFG_DIFFO9_P: X2.50 ; port CFG_DIFF_O_BUS.CFG_DIFFO_p9
CFG_DIFFO10_N: X2.35 ; port CFG_DIFF_O_BUS.CFG_DIFFO_n10
CFG_DIFFO10_P: X2.39 ; port CFG_DIFF_O_BUS.CFG_DIFFO_p10
CFG_DIFFO11_N: X2.38 ; port CFG_DIFF_O_BUS.CFG_DIFFO_n11
CFG_DIFFO11_P: X2.42 ; port CFG_DIFF_O_BUS.CFG_DIFFO_p11
CFG_DIFFO12_N: X2.27 ; port CFG_DIFF_O_BUS.CFG_DIFFO_n12
CFG_DIFFO12_P: X2.31 ; port CFG_DIFF_O_BUS.CFG_DIFFO_p12
CFG_DIFFO13_N: X2.30 ; port CFG_DIFF_O_BUS.CFG_DIFFO_n13
CFG_DIFFO13_P: X2.34 ; port CFG_DIFF_O_BUS.CFG_DIFFO_p13
CFG_DIFFO14_N: X2.19 ; port CFG_DIFF_O_BUS.CFG_DIFFO_n14
CFG_DIFFO14_P: X2.23 ; port CFG_DIFF_O_BUS.CFG_DIFFO_p14
CFG_DIFFO15_N: X2.22 ; port CFG_DIFF_O_BUS.CFG_DIFFO_n15
CFG_DIFFO15_P: X2.26 ; port CFG_DIFF_O_BUS.CFG_DIFFO_p15
CFG_DIFFO16_N: X2.11 ; port CFG_DIFF_O_BUS.CFG_DIFFO_n16
CFG_DIFFO16_P: X2.15 ; port CFG_DIFF_O_BUS.CFG_DIFFO_p16
CFG_DIFFO17_N: X2.14 ; port CFG_DIFF_O_BUS.CFG_DIFFO_n17
CFG_DIFFO17_P: X2.18 ; port CFG_DIFF_O_BUS.CFG_DIFFO_p17
CFG_DIFFO19_N: X2.6 ; port CFG_DIFF_O_BUS.CFG_DIFFO_n19
CFG_DIFFO19_P: X2.10 ; port CFG_DIFF_O_BUS.CFG_DIFFO_p19
CFG_DIFFO_CKO1_N: X2.78 ; port CFG_DIFF_O_BUS.CFG_DIFFO_n1
CFG_DIFFO_CKO1_P: X2.82 ; port CFG_DIFF_O_BUS.CFG_DIFFO_p1
CFG_DIFFO_CKO18_N: X2.3 ; port CFG_DIFF_O_BUS.CFG_DIFFO_n18
CFG_DIFFO_CKO18_P: X2.7 ; port CFG_DIFF_O_BUS.CFG_DIFFO_p18
NetR30_1: R30.1(+) X2.2
NetR31_1: R31.1(+) X2.86
NetR32_2: R32.2(-) X2.83
NetR33_2: R33.2(-) X2.167

### Library data of the parts
R30-R33 = CR0603-#-±5%: Чип резистор

## Sheet Conn_C.SchDoc
size A1
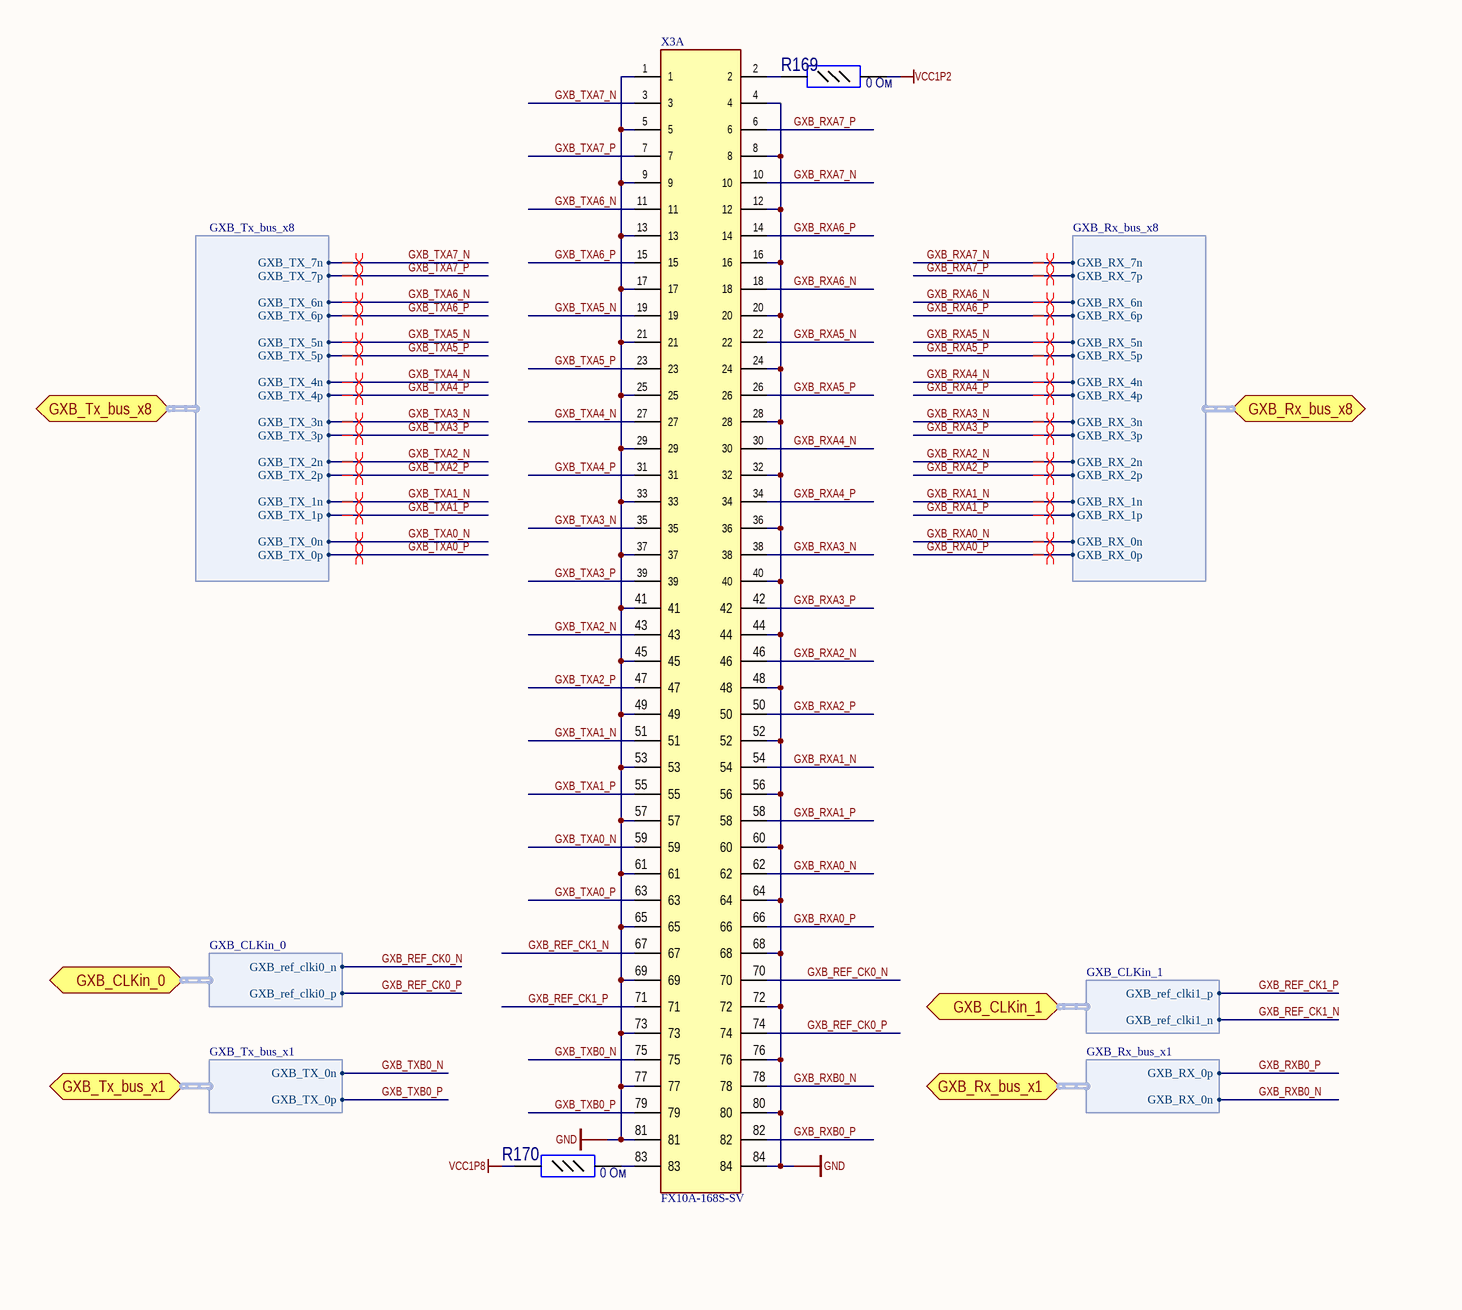
[diagram p3: Conn_C.SchDoc, left]
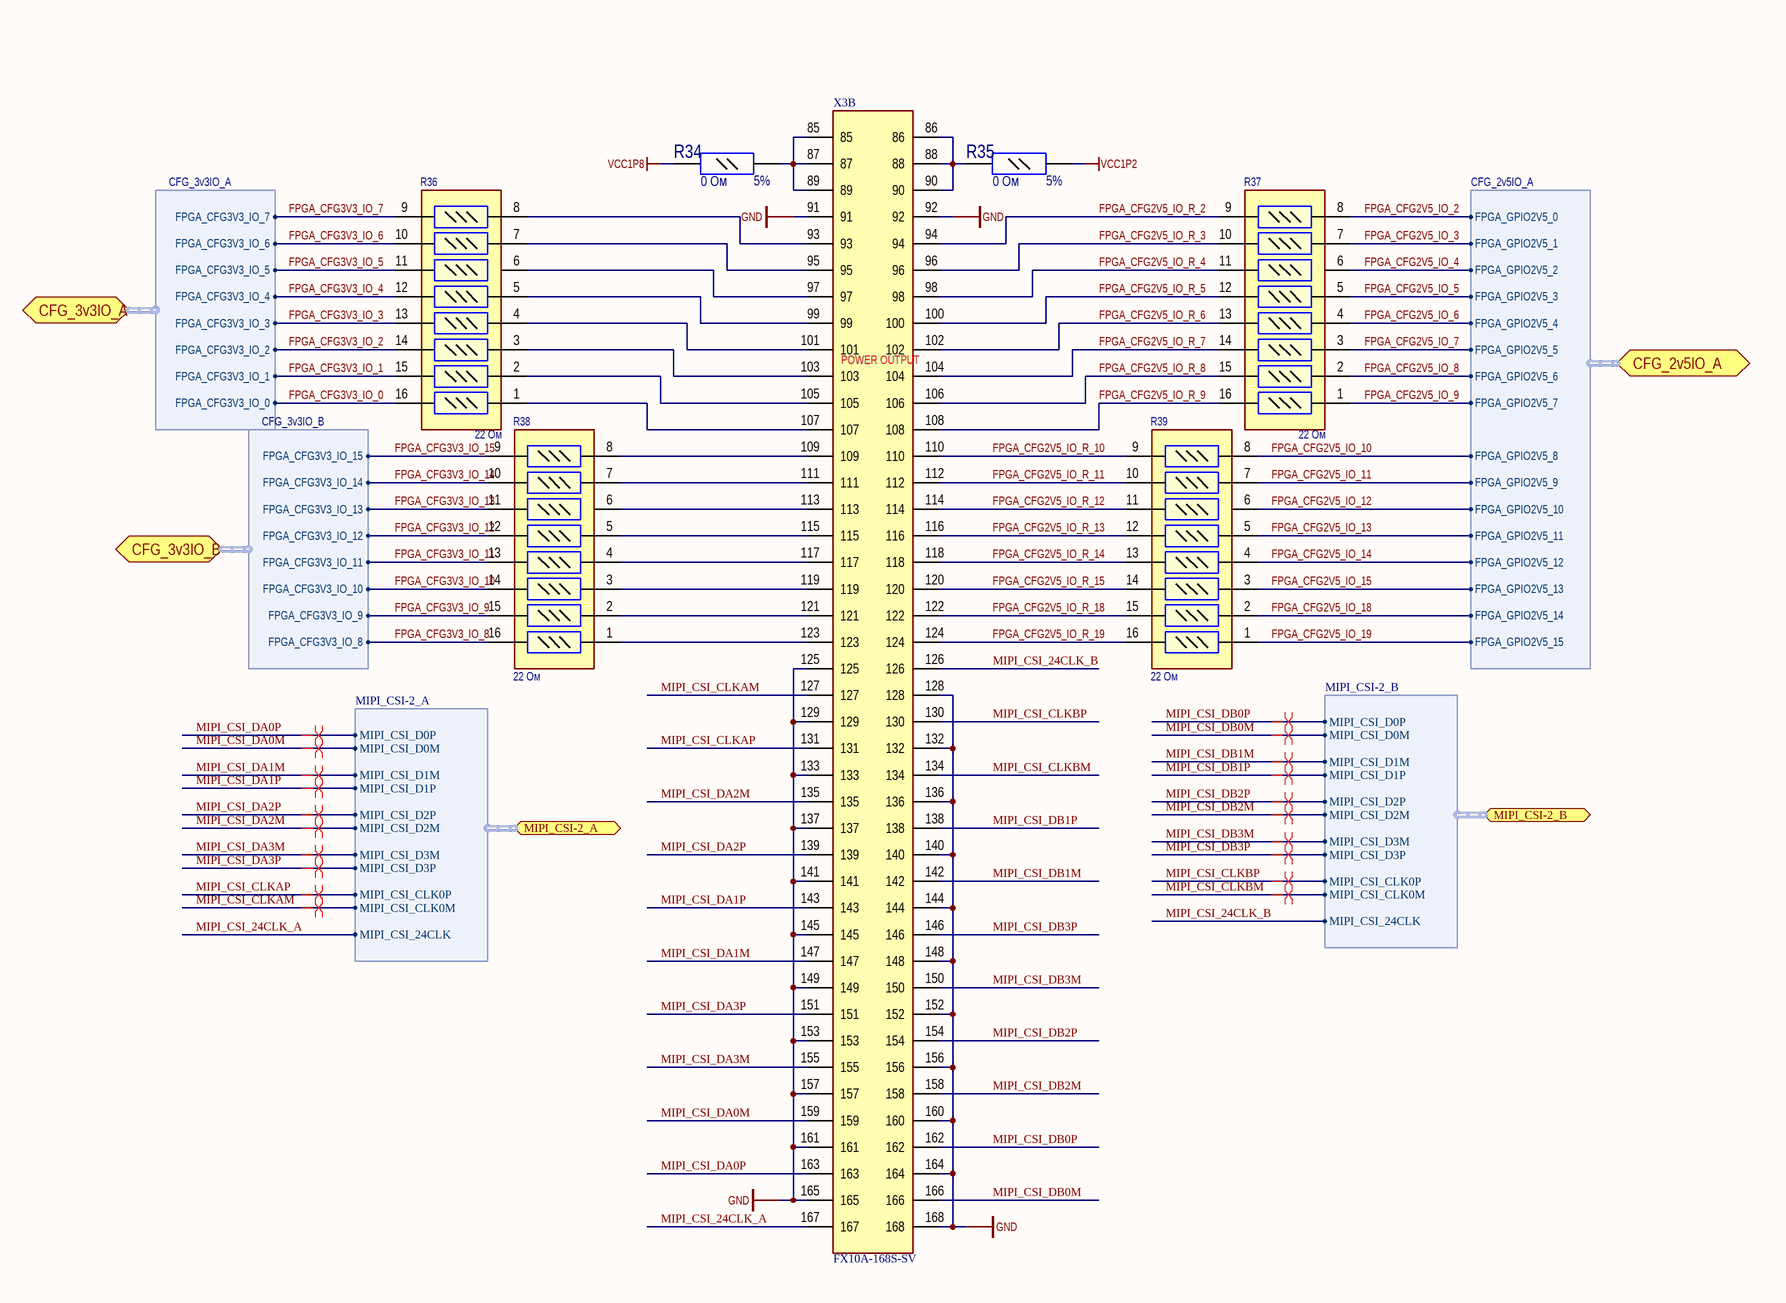
[diagram p4: Conn_C.SchDoc, right]

### Parts
R34  value 0 Ом  TOLERANCE: 5%  [CR0805]  (hidden comment: CR0805-0 Ом-±5%)
R35  value 0 Ом  TOLERANCE: 5%  [CR0805]  (hidden comment: CR0805-0 Ом-±5%)
R36  value 22 Ом  [CAT16-J8]  (hidden comment: YC248-JR-07-22 Ом)
R37  value 22 Ом  [CAT16-J8]  (hidden comment: YC248-JR-07-22 Ом)
R38  value 22 Ом  [CAT16-J8]  (hidden comment: YC248-JR-07-22 Ом)
R39  value 22 Ом  [CAT16-J8]  (hidden comment: YC248-JR-07-22 Ом)
R169  value 0 Ом  [CR0603]  (hidden comment: CR0603-0 Ом-±5%)
R170  value 0 Ом  [CR0603]  (hidden comment: CR0603-0 Ом-±5%)
X3  FX10A-168S-SV  [FX10A-168S-SV]  (parts A,B of 2)

### Ports
CFG_2v5IO_A (harness CFG_2v5IO_A), CFG_3v3IO_A (harness CFG_3v3IO_A), CFG_3v3IO_B (harness CFG_3v3IO_B), GXB_CLKin_0 (harness GXB_CLKin_0), GXB_CLKin_1 (harness GXB_CLKin_1), GXB_Rx_bus_x1 (harness GXB_Rx_bus_x1), GXB_Rx_bus_x8 (harness GXB_Rx_bus_x8), GXB_Tx_bus_x1 (harness GXB_Tx_bus_x1), GXB_Tx_bus_x8 (harness GXB_Tx_bus_x8), MIPI_CSI-2_A (harness MIPI_CSI-2_A), MIPI_CSI-2_B (harness MIPI_CSI-2_B)

### Harnesses
GXB_CLKin_0: GXB_ref_clki0_p, GXB_ref_clki0_n
GXB_Rx_bus_x1: GXB_RX_0p, GXB_RX_0n
GXB_CLKin_1: GXB_ref_clki1_p, GXB_ref_clki1_n
GXB_Tx_bus_x8: GXB_TX_0p, GXB_TX_0n, GXB_TX_1p, GXB_TX_1n, GXB_TX_2p, GXB_TX_2n, GXB_TX_3p, GXB_TX_3n, GXB_TX_4p, GXB_TX_4n, GXB_TX_5p, GXB_TX_5n, GXB_TX_6p, GXB_TX_6n, GXB_TX_7p, GXB_TX_7n
GXB_Tx_bus_x1: GXB_TX_0p, GXB_TX_0n
MIPI_CSI-2_A: MIPI_CSI_D0P, MIPI_CSI_D0M, MIPI_CSI_D1M, MIPI_CSI_D1P, MIPI_CSI_D2P, MIPI_CSI_D2M, MIPI_CSI_D3M, MIPI_CSI_D3P, MIPI_CSI_CLK0P, MIPI_CSI_CLK0M, MIPI_CSI_24CLK
MIPI_CSI-2_B: MIPI_CSI_D0P, MIPI_CSI_D0M, MIPI_CSI_D1M, MIPI_CSI_D1P, MIPI_CSI_CLK0P, MIPI_CSI_CLK0M, MIPI_CSI_24CLK, MIPI_CSI_D2P, MIPI_CSI_D2M, MIPI_CSI_D3M, MIPI_CSI_D3P
CFG_3v3IO_A: FPGA_CFG3V3_IO_0, FPGA_CFG3V3_IO_1, FPGA_CFG3V3_IO_2, FPGA_CFG3V3_IO_3, FPGA_CFG3V3_IO_4, FPGA_CFG3V3_IO_5, FPGA_CFG3V3_IO_6, FPGA_CFG3V3_IO_7
CFG_3v3IO_B: FPGA_CFG3V3_IO_8, FPGA_CFG3V3_IO_9, FPGA_CFG3V3_IO_10, FPGA_CFG3V3_IO_11, FPGA_CFG3V3_IO_12, FPGA_CFG3V3_IO_13, FPGA_CFG3V3_IO_14, FPGA_CFG3V3_IO_15
CFG_2v5IO_A: FPGA_GPIO2V5_0, FPGA_GPIO2V5_1, FPGA_GPIO2V5_2, FPGA_GPIO2V5_3, FPGA_GPIO2V5_4, FPGA_GPIO2V5_5, FPGA_GPIO2V5_6, FPGA_GPIO2V5_7, FPGA_GPIO2V5_8, FPGA_GPIO2V5_9, FPGA_GPIO2V5_10, FPGA_GPIO2V5_11, FPGA_GPIO2V5_12, FPGA_GPIO2V5_13, FPGA_GPIO2V5_14, FPGA_GPIO2V5_15
GXB_Rx_bus_x8: GXB_RX_0p, GXB_RX_0n, GXB_RX_1p, GXB_RX_1n, GXB_RX_2p, GXB_RX_2n, GXB_RX_3p, GXB_RX_3n, GXB_RX_4p, GXB_RX_4n, GXB_RX_5p, GXB_RX_5n, GXB_RX_6p, GXB_RX_6n, GXB_RX_7p, GXB_RX_7n

### Nets
GND: X3.1 X3.4 X3.5 X3.8 X3.9 X3.12 X3.13 X3.16 X3.17 X3.20 X3.21 X3.24 X3.25 X3.28 X3.29 X3.32 X3.33 X3.36 X3.37 X3.40 X3.41 X3.44 X3.45 X3.48 X3.49 X3.52 X3.53 X3.56 X3.57 X3.60 X3.61 X3.64 X3.65 X3.68 X3.69 X3.72 X3.73 X3.76 X3.77 X3.80 X3.81 X3.84 X3.91 X3.92 X3.125 X3.128 X3.129 X3.132 X3.133 X3.136 X3.137 X3.140 X3.141 X3.144 X3.145 X3.148 X3.149 X3.152 X3.153 X3.156 X3.157 X3.160 X3.161 X3.164 X3.165 X3.168
VCC1P2: R35.2(-) R169.2(-)
VCC1P8: R34.1(+) R170.1(+)
FPGA_CFG2V5_IO_2: R37.8 ; port CFG_2v5IO_A.FPGA_GPIO2V5_0
FPGA_CFG2V5_IO_3: R37.7 ; port CFG_2v5IO_A.FPGA_GPIO2V5_1
FPGA_CFG2V5_IO_4: R37.6 ; port CFG_2v5IO_A.FPGA_GPIO2V5_2
FPGA_CFG2V5_IO_5: R37.5 ; port CFG_2v5IO_A.FPGA_GPIO2V5_3
FPGA_CFG2V5_IO_6: R37.4 ; port CFG_2v5IO_A.FPGA_GPIO2V5_4
FPGA_CFG2V5_IO_7: R37.3 ; port CFG_2v5IO_A.FPGA_GPIO2V5_5
FPGA_CFG2V5_IO_8: R37.2 ; port CFG_2v5IO_A.FPGA_GPIO2V5_6
FPGA_CFG2V5_IO_9: R37.1 ; port CFG_2v5IO_A.FPGA_GPIO2V5_7
FPGA_CFG2V5_IO_10: R39.8 ; port CFG_2v5IO_A.FPGA_GPIO2V5_8
FPGA_CFG2V5_IO_11: R39.7 ; port CFG_2v5IO_A.FPGA_GPIO2V5_9
FPGA_CFG2V5_IO_12: R39.6 ; port CFG_2v5IO_A.FPGA_GPIO2V5_10
FPGA_CFG2V5_IO_13: R39.5 ; port CFG_2v5IO_A.FPGA_GPIO2V5_11
FPGA_CFG2V5_IO_14: R39.4 ; port CFG_2v5IO_A.FPGA_GPIO2V5_12
FPGA_CFG2V5_IO_15: R39.3 ; port CFG_2v5IO_A.FPGA_GPIO2V5_13
FPGA_CFG2V5_IO_18: R39.2 ; port CFG_2v5IO_A.FPGA_GPIO2V5_14
FPGA_CFG2V5_IO_19: R39.1 ; port CFG_2v5IO_A.FPGA_GPIO2V5_15
FPGA_CFG2V5_IO_R_2: R37.9 X3.94
FPGA_CFG2V5_IO_R_3: R37.10 X3.96
FPGA_CFG2V5_IO_R_4: R37.11 X3.98
FPGA_CFG2V5_IO_R_5: R37.12 X3.100
FPGA_CFG2V5_IO_R_6: R37.13 X3.102
FPGA_CFG2V5_IO_R_7: R37.14 X3.104
FPGA_CFG2V5_IO_R_8: R37.15 X3.106
FPGA_CFG2V5_IO_R_9: R37.16 X3.108
FPGA_CFG2V5_IO_R_10: R39.9 X3.110
FPGA_CFG2V5_IO_R_11: R39.10 X3.112
FPGA_CFG2V5_IO_R_12: R39.11 X3.114
FPGA_CFG2V5_IO_R_13: R39.12 X3.116
FPGA_CFG2V5_IO_R_14: R39.13 X3.118
FPGA_CFG2V5_IO_R_15: R39.14 X3.120
FPGA_CFG2V5_IO_R_18: R39.15 X3.122
FPGA_CFG2V5_IO_R_19: R39.16 X3.124
FPGA_CFG3V3_IO_0: R36.16 ; port CFG_3v3IO_A.FPGA_CFG3V3_IO_0
FPGA_CFG3V3_IO_1: R36.15 ; port CFG_3v3IO_A.FPGA_CFG3V3_IO_1
FPGA_CFG3V3_IO_2: R36.14 ; port CFG_3v3IO_A.FPGA_CFG3V3_IO_2
FPGA_CFG3V3_IO_3: R36.13 ; port CFG_3v3IO_A.FPGA_CFG3V3_IO_3
FPGA_CFG3V3_IO_4: R36.12 ; port CFG_3v3IO_A.FPGA_CFG3V3_IO_4
FPGA_CFG3V3_IO_5: R36.11 ; port CFG_3v3IO_A.FPGA_CFG3V3_IO_5
FPGA_CFG3V3_IO_6: R36.10 ; port CFG_3v3IO_A.FPGA_CFG3V3_IO_6
FPGA_CFG3V3_IO_7: R36.9 ; port CFG_3v3IO_A.FPGA_CFG3V3_IO_7
FPGA_CFG3V3_IO_8: R38.16 ; port CFG_3v3IO_B.FPGA_CFG3V3_IO_8
FPGA_CFG3V3_IO_9: R38.15 ; port CFG_3v3IO_B.FPGA_CFG3V3_IO_9
FPGA_CFG3V3_IO_10: R38.14 ; port CFG_3v3IO_B.FPGA_CFG3V3_IO_10
FPGA_CFG3V3_IO_11: R38.13 ; port CFG_3v3IO_B.FPGA_CFG3V3_IO_11
FPGA_CFG3V3_IO_12: R38.12 ; port CFG_3v3IO_B.FPGA_CFG3V3_IO_12
FPGA_CFG3V3_IO_13: R38.11 ; port CFG_3v3IO_B.FPGA_CFG3V3_IO_13
FPGA_CFG3V3_IO_14: R38.10 ; port CFG_3v3IO_B.FPGA_CFG3V3_IO_14
FPGA_CFG3V3_IO_15: R38.9 ; port CFG_3v3IO_B.FPGA_CFG3V3_IO_15
GXB_REF_CK0_N: X3.70 ; port GXB_CLKin_0.GXB_ref_clki0_n
GXB_REF_CK0_P: X3.74 ; port GXB_CLKin_0.GXB_ref_clki0_p
GXB_REF_CK1_N: X3.67 ; port GXB_CLKin_1.GXB_ref_clki1_n
GXB_REF_CK1_P: X3.71 ; port GXB_CLKin_1.GXB_ref_clki1_p
GXB_RXA0_N: X3.62 ; port GXB_Rx_bus_x8.GXB_RX_0n
GXB_RXA0_P: X3.66 ; port GXB_Rx_bus_x8.GXB_RX_0p
GXB_RXA1_N: X3.54 ; port GXB_Rx_bus_x8.GXB_RX_1n
GXB_RXA1_P: X3.58 ; port GXB_Rx_bus_x8.GXB_RX_1p
GXB_RXA2_N: X3.46 ; port GXB_Rx_bus_x8.GXB_RX_2n
GXB_RXA2_P: X3.50 ; port GXB_Rx_bus_x8.GXB_RX_2p
GXB_RXA3_N: X3.38 ; port GXB_Rx_bus_x8.GXB_RX_3n
GXB_RXA3_P: X3.42 ; port GXB_Rx_bus_x8.GXB_RX_3p
GXB_RXA4_N: X3.30 ; port GXB_Rx_bus_x8.GXB_RX_4n
GXB_RXA4_P: X3.34 ; port GXB_Rx_bus_x8.GXB_RX_4p
GXB_RXA5_N: X3.22 ; port GXB_Rx_bus_x8.GXB_RX_5n
GXB_RXA5_P: X3.26 ; port GXB_Rx_bus_x8.GXB_RX_5p
GXB_RXA6_N: X3.18 ; port GXB_Rx_bus_x8.GXB_RX_6n
GXB_RXA6_P: X3.14 ; port GXB_Rx_bus_x8.GXB_RX_6p
GXB_RXA7_N: X3.10 ; port GXB_Rx_bus_x8.GXB_RX_7n
GXB_RXA7_P: X3.6 ; port GXB_Rx_bus_x8.GXB_RX_7p
GXB_RXB0_N: X3.78 ; port GXB_Rx_bus_x1.GXB_RX_0n
GXB_RXB0_P: X3.82 ; port GXB_Rx_bus_x1.GXB_RX_0p
GXB_TXA0_N: X3.59 ; port GXB_Tx_bus_x8.GXB_TX_0n
GXB_TXA0_P: X3.63 ; port GXB_Tx_bus_x8.GXB_TX_0p
GXB_TXA1_N: X3.51 ; port GXB_Tx_bus_x8.GXB_TX_1n
GXB_TXA1_P: X3.55 ; port GXB_Tx_bus_x8.GXB_TX_1p
GXB_TXA2_N: X3.43 ; port GXB_Tx_bus_x8.GXB_TX_2n
GXB_TXA2_P: X3.47 ; port GXB_Tx_bus_x8.GXB_TX_2p
GXB_TXA3_N: X3.35 ; port GXB_Tx_bus_x8.GXB_TX_3n
GXB_TXA3_P: X3.39 ; port GXB_Tx_bus_x8.GXB_TX_3p
GXB_TXA4_N: X3.27 ; port GXB_Tx_bus_x8.GXB_TX_4n
GXB_TXA4_P: X3.31 ; port GXB_Tx_bus_x8.GXB_TX_4p
GXB_TXA5_N: X3.19 ; port GXB_Tx_bus_x8.GXB_TX_5n
GXB_TXA5_P: X3.23 ; port GXB_Tx_bus_x8.GXB_TX_5p
GXB_TXA6_N: X3.11 ; port GXB_Tx_bus_x8.GXB_TX_6n
GXB_TXA6_P: X3.15 ; port GXB_Tx_bus_x8.GXB_TX_6p
GXB_TXA7_N: X3.3 ; port GXB_Tx_bus_x8.GXB_TX_7n
GXB_TXA7_P: X3.7 ; port GXB_Tx_bus_x8.GXB_TX_7p
GXB_TXB0_N: X3.75 ; port GXB_Tx_bus_x1.GXB_TX_0n
GXB_TXB0_P: X3.79 ; port GXB_Tx_bus_x1.GXB_TX_0p
MIPI_CSI_24CLK_A: X3.167 ; port MIPI_CSI-2_A.MIPI_CSI_24CLK
MIPI_CSI_24CLK_B: X3.126 ; port MIPI_CSI-2_B.MIPI_CSI_24CLK
MIPI_CSI_CLKAM: X3.127 ; port MIPI_CSI-2_A.MIPI_CSI_CLK0M
MIPI_CSI_CLKAP: X3.131 ; port MIPI_CSI-2_A.MIPI_CSI_CLK0P
MIPI_CSI_CLKBM: X3.134 ; port MIPI_CSI-2_B.MIPI_CSI_CLK0M
MIPI_CSI_CLKBP: X3.130 ; port MIPI_CSI-2_B.MIPI_CSI_CLK0P
MIPI_CSI_DA0M: X3.159 ; port MIPI_CSI-2_A.MIPI_CSI_D0M
MIPI_CSI_DA0P: X3.163 ; port MIPI_CSI-2_A.MIPI_CSI_D0P
MIPI_CSI_DA1M: X3.147 ; port MIPI_CSI-2_A.MIPI_CSI_D1M
MIPI_CSI_DA1P: X3.143 ; port MIPI_CSI-2_A.MIPI_CSI_D1P
MIPI_CSI_DA2M: X3.135 ; port MIPI_CSI-2_A.MIPI_CSI_D2M
MIPI_CSI_DA2P: X3.139 ; port MIPI_CSI-2_A.MIPI_CSI_D2P
MIPI_CSI_DA3M: X3.155 ; port MIPI_CSI-2_A.MIPI_CSI_D3M
MIPI_CSI_DA3P: X3.151 ; port MIPI_CSI-2_A.MIPI_CSI_D3P
MIPI_CSI_DB0M: X3.166 ; port MIPI_CSI-2_B.MIPI_CSI_D0M
MIPI_CSI_DB0P: X3.162 ; port MIPI_CSI-2_B.MIPI_CSI_D0P
MIPI_CSI_DB1M: X3.142 ; port MIPI_CSI-2_B.MIPI_CSI_D1M
MIPI_CSI_DB1P: X3.138 ; port MIPI_CSI-2_B.MIPI_CSI_D1P
MIPI_CSI_DB2M: X3.158 ; port MIPI_CSI-2_B.MIPI_CSI_D2M
MIPI_CSI_DB2P: X3.154 ; port MIPI_CSI-2_B.MIPI_CSI_D2P
MIPI_CSI_DB3M: X3.150 ; port MIPI_CSI-2_B.MIPI_CSI_D3M
MIPI_CSI_DB3P: X3.146 ; port MIPI_CSI-2_B.MIPI_CSI_D3P
NetR34_2: R34.2(-) X3.85 X3.87 X3.89
NetR35_1: R35.1(+) X3.86 X3.88 X3.90
NetR36_1: R36.1 X3.107
NetR36_2: R36.2 X3.105
NetR36_3: R36.3 X3.103
NetR36_4: R36.4 X3.101
NetR36_5: R36.5 X3.99
NetR36_6: R36.6 X3.97
NetR36_7: R36.7 X3.95
NetR36_8: R36.8 X3.93
NetR38_1: R38.1 X3.123
NetR38_2: R38.2 X3.121
NetR38_3: R38.3 X3.119
NetR38_4: R38.4 X3.117
NetR38_5: R38.5 X3.115
NetR38_6: R38.6 X3.113
NetR38_7: R38.7 X3.111
NetR38_8: R38.8 X3.109
NetR169_1: R169.1(+) X3.2
NetR170_2: R170.2(-) X3.83

### Layout directives
differential pair: GXB_RXA0_N, GXB_RXA0_P, GXB_RXA1_N, GXB_RXA1_P, GXB_RXA2_N, GXB_RXA2_P, GXB_RXA3_N, GXB_RXA3_P, GXB_RXA4_N, GXB_RXA4_P, GXB_RXA5_N, GXB_RXA5_P, GXB_RXA6_N, GXB_RXA6_P, GXB_RXA7_N, GXB_RXA7_P, GXB_TXA0_N, GXB_TXA0_P, GXB_TXA1_N, GXB_TXA1_P, GXB_TXA2_N, GXB_TXA2_P, GXB_TXA3_N, GXB_TXA3_P, GXB_TXA4_N, GXB_TXA4_P, GXB_TXA5_N, GXB_TXA5_P, GXB_TXA6_N, GXB_TXA6_P, GXB_TXA7_N, GXB_TXA7_P, MIPI_CSI_CLKAM, MIPI_CSI_CLKAP, MIPI_CSI_CLKBM, MIPI_CSI_CLKBP, MIPI_CSI_DA0M, MIPI_CSI_DA0P, MIPI_CSI_DA1M, MIPI_CSI_DA1P, MIPI_CSI_DA2M, MIPI_CSI_DA2P, MIPI_CSI_DA3M, MIPI_CSI_DA3P, MIPI_CSI_DB0M, MIPI_CSI_DB0P, MIPI_CSI_DB1M, MIPI_CSI_DB1P, MIPI_CSI_DB2M, MIPI_CSI_DB2P, MIPI_CSI_DB3M, MIPI_CSI_DB3P

### Notes on the sheet
- (near X3) POWER OUTPUT

### Library data of the parts
R34 R35 = CR0805-#-±1%: Чип резистор
R36-R39 = YC248-JR-07-#: Набор чип резисторов; P: 0.062 Вт; Supplier 1: Digi-Key; Supplier Part Number 1: YC248-JR-0722RL
R169 R170 = CR0603-#-±5%: Чип резистор